# Altium project ControlBoard.PrjPCB (part 1 of 2)
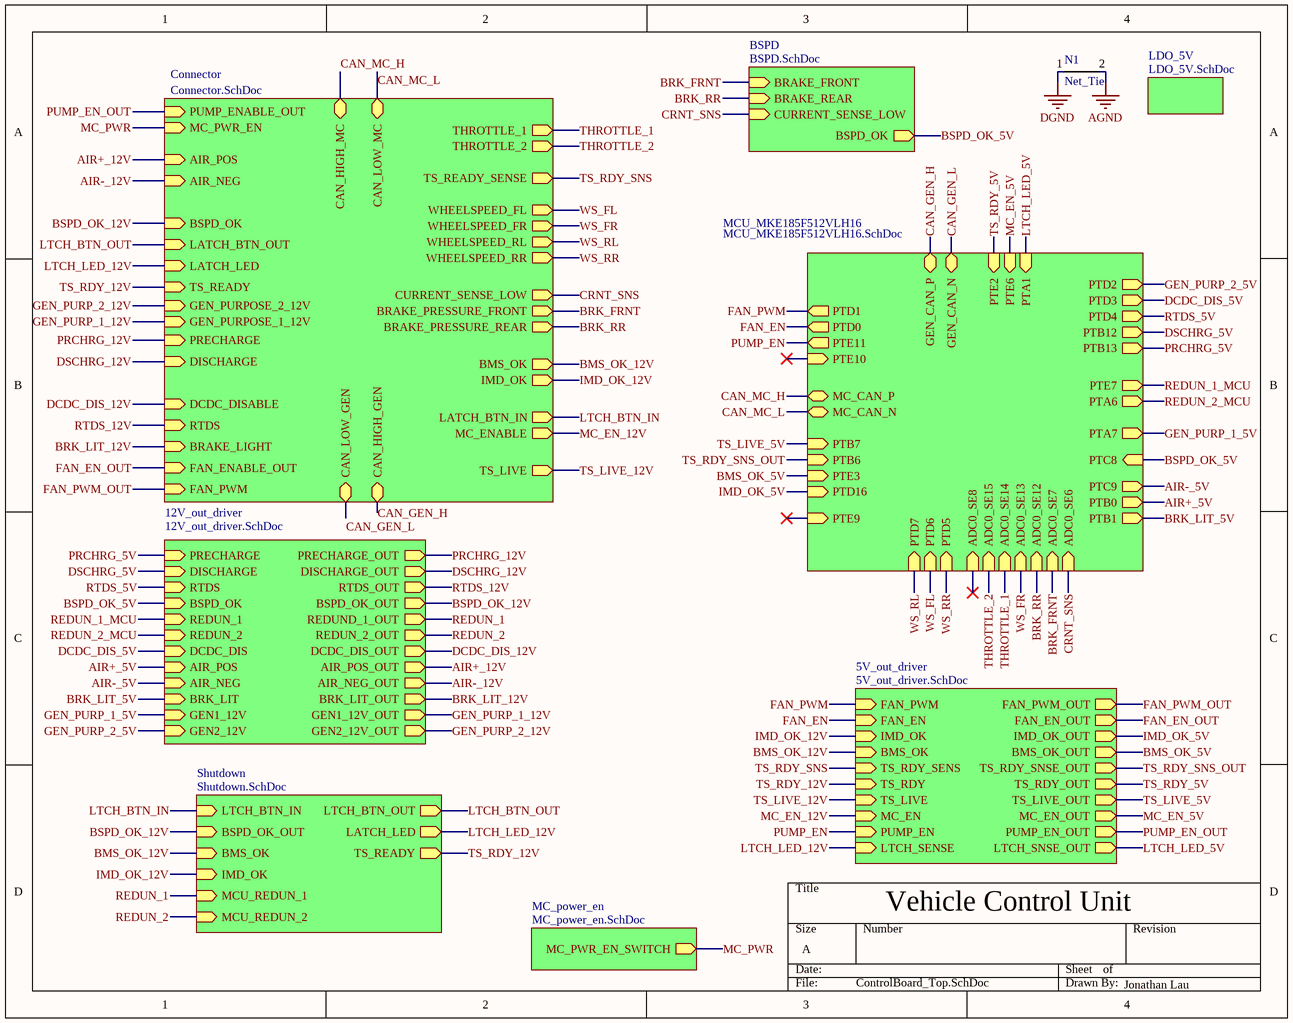
[diagram p0: ControlBoard_Top.SchDoc]
12 sheets, 198 parts. Net scope: hierarchical (ports join the sheet entries above them; power ports are global).
Board files: ControlBoard.PcbDoc, ControlBoard_v2.PcbDoc, ControlBoard_v3.PcbDoc, ControlBoard_v4.PcbDoc
Sheets:
  ControlBoard_Top.SchDoc
    5V_out_driver = 5V_out_driver.SchDoc
    12V_out_driver = 12V_out_driver.SchDoc
    Connector = Connector.SchDoc
      Designator = RVP_OVP_HC.SchDoc
    Shutdown = Shutdown.SchDoc
    BSPD = BSPD.SchDoc
    LDO_5V = LDO_5V.SchDoc
    MC_power_en = MC_power_en.SchDoc
    MCU_MKE185F512VLH16 = MCU_MKE185F512VLH16.SchDoc
      USB = USB.SchDoc
      MC = CAN_Tranceiver.SchDoc
      GEN = CAN_Tranceiver.SchDoc

## Sheet ControlBoard_Top.SchDoc
size A

### Parts
N1  Net_Tie  [Net_Tie]

### Sub-sheets
5V_out_driver = 5V_out_driver.SchDoc: FAN_PWM (in), IMD_OK (in), IMD_OK_OUT (out), MC_EN_OUT (out), TS_LIVE_OUT (out), FAN_PWM_OUT (out), BMS_OK (in), MC_EN (in), TS_LIVE (in), BMS_OK_OUT (out), TS_RDY_OUT (out), FAN_EN_OUT (out), TS_RDY (in), TS_RDY_SENS (in), FAN_EN (in), TS_RDY_SNSE_OUT (out), PUMP_EN_OUT (out), PUMP_EN (in), LTCH_SENSE (in), LTCH_SNSE_OUT (out)
12V_out_driver = 12V_out_driver.SchDoc: PRECHARGE (in), DISCHARGE (in), RTDS (in), BSPD_OK (in), RTDS_OUT (out), PRECHARGE_OUT (out), DISCHARGE_OUT (out), BSPD_OK_OUT (out), REDUN_1 (in), REDUN_2 (in), REDUND_1_OUT (out), REDUN_2_OUT (out), DCDC_DIS_OUT (out), DCDC_DIS (in), BRK_LIT (in), BRK_LIT_OUT (out), GEN2_12V_OUT (out), GEN2_12V (in), GEN1_12V (in), GEN1_12V_OUT (out), AIR_NEG_OUT (out), AIR_POS (in), AIR_NEG (in), AIR_POS_OUT (out)
BSPD = BSPD.SchDoc: BRAKE_FRONT (in), BRAKE_REAR (in), CURRENT_SENSE_LOW (in), BSPD_OK (out)
Connector = Connector.SchDoc: PUMP_ENABLE_OUT (in), MC_PWR_EN (in), THROTTLE_1 (out), WHEELSPEED_RL (out), CURRENT_SENSE_LOW (out), DISCHARGE (in), RTDS (in), WHEELSPEED_FL (out), FAN_ENABLE_OUT (in), MC_ENABLE (out), PRECHARGE (in), CAN_HIGH_GEN (bidir), CAN_LOW_GEN (bidir), BSPD_OK (in), TS_READY_SENSE (out), TS_READY (in), FAN_PWM (in), LATCH_BTN_IN (out), BRAKE_PRESSURE_REAR (out), LATCH_BTN_OUT (in), LATCH_LED (in), WHEELSPEED_FR (out), DCDC_DISABLE (in), BRAKE_LIGHT (in), CAN_LOW_MC (bidir), WHEELSPEED_RR (out), CAN_HIGH_MC (bidir), IMD_OK (out), THROTTLE_2 (out), BRAKE_PRESSURE_FRONT (out), BMS_OK (out), TS_LIVE (out), GEN_PURPOSE_2_12V (in), GEN_PURPOSE_1_12V (in), AIR_NEG (in), AIR_POS (in)
LDO_5V = LDO_5V.SchDoc: no entries
MC_power_en = MC_power_en.SchDoc: MC_PWR_EN_SWITCH (out)
MCU_MKE185F512VLH16 = MCU_MKE185F512VLH16.SchDoc: ADC0_SE6 (in), PTA6 (out), PTD3 (out), PTA1 (in), PTD1 (out), PTB12 (out), PTB13 (out), PTE7 (out), PTB7 (in), PTB6 (in), PTD16 (in), PTE2 (in), PTD4 (out), PTD0 (out), ADC0_SE7 (in), ADC0_SE12 (in), ADC0_SE13 (in), ADC0_SE14 (in), ADC0_SE15 (in), ADC0_SE8 (in), PTE3 (in), PTB0 (out), PTE6 (in), PTD5 (in), PTE9 (in), PTE10 (in), PTE11 (out), PTD6 (in), PTD7 (in), GEN_CAN_P (bidir), MC_CAN_P (bidir), GEN_CAN_N (bidir), MC_CAN_N (bidir), PTC9 (out), PTB1 (out), PTC8 (in), PTA7 (out), PTD2 (out)
Shutdown = Shutdown.SchDoc: BSPD_OK_OUT (in), TS_READY (out), LATCH_LED (out), IMD_OK (in), BMS_OK (in), LTCH_BTN_OUT (out), LTCH_BTN_IN (in), MCU_REDUN_2 (in), MCU_REDUN_1 (in)

### Nets
AGND: N1.2
DGND: N1.1
AIR+_5V: sheet 12V_out_driver/AIR_POS, sheet MCU_MKE185F512VLH16/PTB0
AIR+_12V: sheet 12V_out_driver/AIR_POS_OUT, sheet Connector/AIR_POS
AIR-_5V: sheet 12V_out_driver/AIR_NEG, sheet MCU_MKE185F512VLH16/PTC9
AIR-_12V: sheet 12V_out_driver/AIR_NEG_OUT, sheet Connector/AIR_NEG
BMS_OK_5V: sheet 5V_out_driver/BMS_OK_OUT, sheet MCU_MKE185F512VLH16/PTE3
BMS_OK_12V: sheet 5V_out_driver/BMS_OK, sheet Connector/BMS_OK, sheet Shutdown/BMS_OK  [project net BMS_OK]
BRK_FRNT: sheet Connector/BRAKE_PRESSURE_FRONT, sheet BSPD/BRAKE_FRONT, sheet MCU_MKE185F512VLH16/ADC0_SE7  [project net 5]
BRK_LIT_5V: sheet 12V_out_driver/BRK_LIT, sheet MCU_MKE185F512VLH16/PTB1
BRK_LIT_12V: sheet 12V_out_driver/BRK_LIT_OUT, sheet Connector/BRAKE_LIGHT  [project net BRK_LIGHT_OUT]
BRK_RR: sheet Connector/BRAKE_PRESSURE_REAR, sheet BSPD/BRAKE_REAR, sheet MCU_MKE185F512VLH16/ADC0_SE12  [project net 6]
BSPD_OK_5V: sheet 12V_out_driver/BSPD_OK, sheet BSPD/BSPD_OK, sheet MCU_MKE185F512VLH16/PTC8
BSPD_OK_12V: sheet 12V_out_driver/BSPD_OK_OUT, sheet Connector/BSPD_OK, sheet Shutdown/BSPD_OK_OUT
CAN_GEN_H: sheet Connector/CAN_HIGH_GEN, sheet MCU_MKE185F512VLH16/GEN_CAN_P
CAN_GEN_L: sheet Connector/CAN_LOW_GEN, sheet MCU_MKE185F512VLH16/GEN_CAN_N
CAN_MC_H: sheet Connector/CAN_HIGH_MC, sheet MCU_MKE185F512VLH16/MC_CAN_P
CAN_MC_L: sheet Connector/CAN_LOW_MC, sheet MCU_MKE185F512VLH16/MC_CAN_N
CRNT_SNS: sheet Connector/CURRENT_SENSE_LOW, sheet BSPD/CURRENT_SENSE_LOW, sheet MCU_MKE185F512VLH16/ADC0_SE6  [project net 1]
DCDC_DIS_5V: sheet 12V_out_driver/DCDC_DIS, sheet MCU_MKE185F512VLH16/PTD3
DCDC_DIS_12V: sheet 12V_out_driver/DCDC_DIS_OUT, sheet Connector/DCDC_DISABLE
DSCHRG_5V: sheet 12V_out_driver/DISCHARGE, sheet MCU_MKE185F512VLH16/PTB12
DSCHRG_12V: sheet 12V_out_driver/DISCHARGE_OUT, sheet Connector/DISCHARGE
FAN_EN: sheet 5V_out_driver/FAN_EN, sheet MCU_MKE185F512VLH16/PTD0
FAN_EN_OUT: sheet 5V_out_driver/FAN_EN_OUT, sheet Connector/FAN_ENABLE_OUT
FAN_PWM: sheet 5V_out_driver/FAN_PWM, sheet MCU_MKE185F512VLH16/PTD1
FAN_PWM_OUT: sheet 5V_out_driver/FAN_PWM_OUT, sheet Connector/FAN_PWM
GEN_PURP_1_5V: sheet 12V_out_driver/GEN1_12V, sheet MCU_MKE185F512VLH16/PTA7
GEN_PURP_1_12V: sheet 12V_out_driver/GEN1_12V_OUT, sheet Connector/GEN_PURPOSE_1_12V  [project net GEN1_OUT]
GEN_PURP_2_5V: sheet 12V_out_driver/GEN2_12V, sheet MCU_MKE185F512VLH16/PTD2
GEN_PURP_2_12V: sheet 12V_out_driver/GEN2_12V_OUT, sheet Connector/GEN_PURPOSE_2_12V  [project net GEN2_OUT]
IMD_OK_5V: sheet 5V_out_driver/IMD_OK_OUT, sheet MCU_MKE185F512VLH16/PTD16
IMD_OK_12V: sheet 5V_out_driver/IMD_OK, sheet Connector/IMD_OK, sheet Shutdown/IMD_OK  [project net IMD_OK]
LTCH_BTN_IN: sheet Connector/LATCH_BTN_IN, sheet Shutdown/LTCH_BTN_IN
LTCH_BTN_OUT: sheet Connector/LATCH_BTN_OUT, sheet Shutdown/LTCH_BTN_OUT
LTCH_LED_5V: sheet 5V_out_driver/LTCH_SNSE_OUT, sheet MCU_MKE185F512VLH16/PTA1  [project net LATCH_SENSE_OUT]
LTCH_LED_12V: sheet 5V_out_driver/LTCH_SENSE, sheet Connector/LATCH_LED, sheet Shutdown/LATCH_LED
MC_EN_5V: sheet 5V_out_driver/MC_EN_OUT, sheet MCU_MKE185F512VLH16/PTE6
MC_EN_12V: sheet 5V_out_driver/MC_EN, sheet Connector/MC_ENABLE  [project net MC_EN]
MC_PWR: sheet Connector/MC_PWR_EN, sheet MC_power_en/MC_PWR_EN_SWITCH
PRCHRG_5V: sheet 12V_out_driver/PRECHARGE, sheet MCU_MKE185F512VLH16/PTB13
PRCHRG_12V: sheet 12V_out_driver/PRECHARGE_OUT, sheet Connector/PRECHARGE
PUMP_EN: sheet 5V_out_driver/PUMP_EN, sheet MCU_MKE185F512VLH16/PTE11
PUMP_EN_OUT: sheet 5V_out_driver/PUMP_EN_OUT, sheet Connector/PUMP_ENABLE_OUT
REDUN_1: sheet 12V_out_driver/REDUND_1_OUT, sheet Shutdown/MCU_REDUN_1  [project net MCU_REDUN_1_OUT]
REDUN_1_MCU: sheet 12V_out_driver/REDUN_1, sheet MCU_MKE185F512VLH16/PTE7
REDUN_2: sheet 12V_out_driver/REDUN_2_OUT, sheet Shutdown/MCU_REDUN_2  [project net MCU_REDUN_2_OUT]
REDUN_2_MCU: sheet 12V_out_driver/REDUN_2, sheet MCU_MKE185F512VLH16/PTA6
RTDS_5V: sheet 12V_out_driver/RTDS, sheet MCU_MKE185F512VLH16/PTD4
RTDS_12V: sheet 12V_out_driver/RTDS_OUT, sheet Connector/RTDS
THROTTLE_1: sheet Connector/THROTTLE_1, sheet MCU_MKE185F512VLH16/ADC0_SE14  [project net 3]
THROTTLE_2: sheet Connector/THROTTLE_2, sheet MCU_MKE185F512VLH16/ADC0_SE15  [project net 4]
TS_LIVE_5V: sheet 5V_out_driver/TS_LIVE_OUT, sheet MCU_MKE185F512VLH16/PTB7
TS_LIVE_12V: sheet 5V_out_driver/TS_LIVE, sheet Connector/TS_LIVE
TS_RDY_5V: sheet 5V_out_driver/TS_RDY_OUT, sheet MCU_MKE185F512VLH16/PTE2
TS_RDY_12V: sheet 5V_out_driver/TS_RDY, sheet Connector/TS_READY, sheet Shutdown/TS_READY
TS_RDY_SNS: sheet 5V_out_driver/TS_RDY_SENS, sheet Connector/TS_READY_SENSE
TS_RDY_SNS_OUT: sheet 5V_out_driver/TS_RDY_SNSE_OUT, sheet MCU_MKE185F512VLH16/PTB6
WS_FL: sheet Connector/WHEELSPEED_FL, sheet MCU_MKE185F512VLH16/PTD6  [project net 8]
WS_FR: sheet Connector/WHEELSPEED_FR, sheet MCU_MKE185F512VLH16/ADC0_SE13  [project net 7]
WS_RL: sheet Connector/WHEELSPEED_RL, sheet MCU_MKE185F512VLH16/PTD7  [project net 10]
WS_RR: sheet Connector/WHEELSPEED_RR, sheet MCU_MKE185F512VLH16/PTD5  [project net 9]

### Notes on the sheet
- Vehicle Control Unit
- Jonathan Lau

### Library data of the parts
N1 = 1: Manufacturer_id: 1; idFuse: 3; Name: Net Tie; Drawer_id: 1; idShunt: 1

## Sheet 5V_out_driver.SchDoc
size A
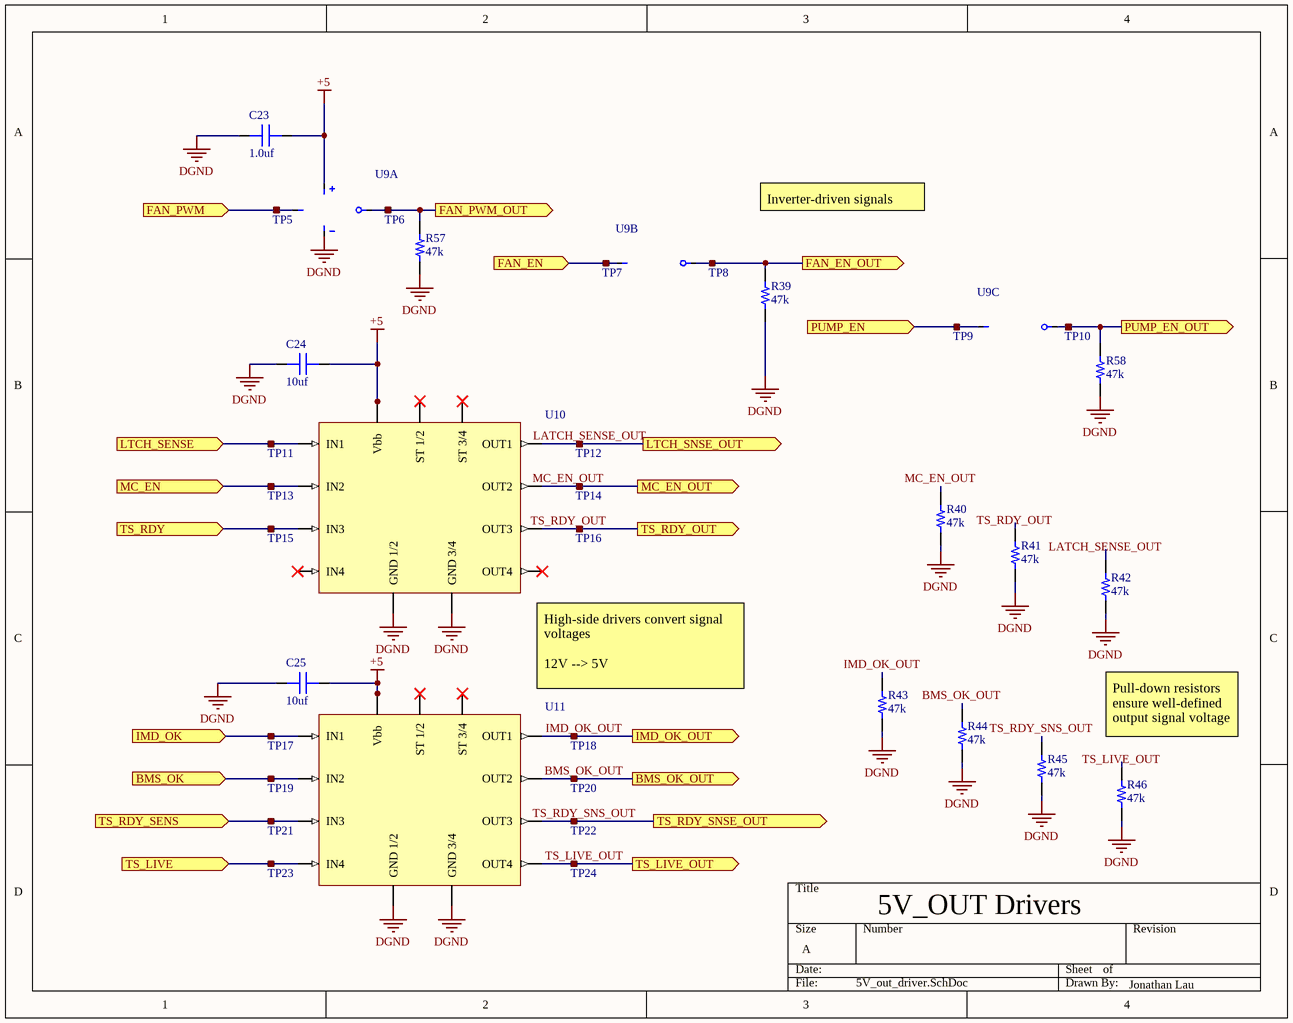
[diagram p1: 5V_out_driver.SchDoc]

### Parts
C23  value 1.0uf  [CAP 0603/1608]  (hidden comment: Capacitor MLCC 1.0uf 16V CAP 0603/1608)
C24  value 10uf  [CAP 0603/1608]  (hidden comment: Capacitor MLCC 10uf 16V CAP 0603/1608)
C25  value 10uf  [CAP 0603/1608]  (hidden comment: Capacitor MLCC 10uf 16V CAP 0603/1608)
R39  value 47k  [RES 0805/2012]  (hidden comment: Resistor 47k 0805 1/4W 5%)
R40  value 47k  [RES 0805/2012]  (hidden comment: Resistor 47k 0805 1/4W 5%)
R41  value 47k  [RES 0805/2012]  (hidden comment: Resistor 47k 0805 1/4W 5%)
R42  value 47k  [RES 0805/2012]  (hidden comment: Resistor 47k 0805 1/4W 5%)
R43  value 47k  [RES 0805/2012]  (hidden comment: Resistor 47k 0805 1/4W 5%)
R44  value 47k  [RES 0805/2012]  (hidden comment: Resistor 47k 0805 1/4W 5%)
R45  value 47k  [RES 0805/2012]  (hidden comment: Resistor 47k 0805 1/4W 5%)
R46  value 47k  [RES 0805/2012]  (hidden comment: Resistor 47k 0805 1/4W 5%)
R57  value 47k  [RES 0805/2012]  (hidden comment: Resistor 47k 0805 1/4W 5%)
R58  value 47k  [RES 0805/2012]  (hidden comment: Resistor 47k 0805 1/4W 5%)
TP5  RCU-0C  [RCU-0C]  (value not drawn)
TP6  RCU-0C  [RCU-0C]  (value not drawn)
TP7  RCU-0C  [RCU-0C]  (value not drawn)
TP8  RCU-0C  [RCU-0C]  (value not drawn)
TP9  RCU-0C  [RCU-0C]  (value not drawn)
TP10  RCU-0C  [RCU-0C]  (value not drawn)
TP11  RCU-0C  [RCU-0C]  (value not drawn)
TP12  RCU-0C  [RCU-0C]  (value not drawn)
TP13  RCU-0C  [RCU-0C]  (value not drawn)
TP14  RCU-0C  [RCU-0C]  (value not drawn)
TP15  RCU-0C  [RCU-0C]  (value not drawn)
TP16  RCU-0C  [RCU-0C]  (value not drawn)
TP17  RCU-0C  [RCU-0C]  (value not drawn)
TP18  RCU-0C  [RCU-0C]  (value not drawn)
TP19  RCU-0C  [RCU-0C]  (value not drawn)
TP20  RCU-0C  [RCU-0C]  (value not drawn)
TP21  RCU-0C  [RCU-0C]  (value not drawn)
TP22  RCU-0C  [RCU-0C]  (value not drawn)
TP23  RCU-0C  [RCU-0C]  (value not drawn)
TP24  RCU-0C  [RCU-0C]  (value not drawn)
U9  SN74LVC3G14DCUR  [R-PDSO-G8]  (value not drawn)  (parts A,B,C of 3)
U10  PG-DSO-20  [PG-DSO-20]  (value not drawn)
U11  PG-DSO-20  [PG-DSO-20]  (value not drawn)

### Ports
BMS_OK (in), BMS_OK_OUT (out), FAN_EN (in), FAN_EN_OUT (out), FAN_PWM (in), FAN_PWM_OUT (out), IMD_OK (in), IMD_OK_OUT (out), LTCH_SENSE (in), LTCH_SNSE_OUT (out), MC_EN (in), MC_EN_OUT (out), PUMP_EN (in), PUMP_EN_OUT (out), TS_LIVE (in), TS_LIVE_OUT (out), TS_RDY (in), TS_RDY_OUT (out), TS_RDY_SENS (in), TS_RDY_SNSE_OUT (out)

### Nets
+5: C23.2 C24.1 C25.1 U9.8(Vcc) U10.1(Vbb) U10.10(Vbb) U10.11(Vbb) U10.12(Vbb) U10.15(Vbb) U10.16(Vbb) U10.19(Vbb) U10.20(Vbb) U11.1(Vbb) U11.10(Vbb) U11.11(Vbb) U11.12(Vbb) U11.15(Vbb) U11.16(Vbb) U11.19(Vbb) U11.20(Vbb)  [project net DVCC]
DGND: C23.1 C24.2 C25.2 R39.1 R40.1 R41.1 R42.1 R43.2 R44.1 R45.1 R46.1 R57.1 R58.1 U9.4(GND) U10.2(GND_1/2) U10.6(GND_3/4) U11.2(GND_1/2) U11.6(GND_3/4)
BMS_OK: TP19.1 U11.5(IN2) ; port BMS_OK
BMS_OK_OUT: R44.2 TP20.1 U11.17(OUT2) ; port BMS_OK_OUT  [project net BMS_OK_5V]
FAN_EN: TP7.1 U9.3(2A) ; port FAN_EN
FAN_EN_OUT: R39.2 TP8.1 U9.5(2Y) ; port FAN_EN_OUT
FAN_PWM: TP5.1 U9.1(1A) ; port FAN_PWM
FAN_PWM_OUT: R57.2 TP6.1 U9.7(1Y) ; port FAN_PWM_OUT
IMD_OK: TP17.1 U11.3(IN1) ; port IMD_OK
IMD_OK_OUT: R43.1 TP18.1 U11.18(OUT1) ; port IMD_OK_OUT  [project net IMD_OK_5V]
LATCH_SENSE_OUT: R42.2 TP12.1 U10.18(OUT1) ; port LTCH_SNSE_OUT
LTCH_LED_12V: TP11.1 U10.3(IN1) ; port LTCH_SENSE
MC_EN: TP13.1 U10.5(IN2) ; port MC_EN
MC_EN_OUT: R40.2 TP14.1 U10.17(OUT2) ; port MC_EN_OUT  [project net MC_EN_5V]
PUMP_EN: TP9.1 U9.6(3A) ; port PUMP_EN
PUMP_EN_OUT: R58.2 TP10.1 U9.2(3Y) ; port PUMP_EN_OUT
TS_LIVE_12V: TP23.1 U11.9(IN4) ; port TS_LIVE
TS_LIVE_OUT: R46.2 TP24.1 U11.13(OUT4) ; port TS_LIVE_OUT  [project net TS_LIVE_5V]
TS_RDY_12V: TP15.1 U10.7(IN3) ; port TS_RDY
TS_RDY_OUT: R41.2 TP16.1 U10.14(OUT3) ; port TS_RDY_OUT  [project net TS_RDY_5V]
TS_RDY_SNS: TP21.1 U11.7(IN3) ; port TS_RDY_SENS
TS_RDY_SNS_OUT: R45.2 TP22.1 U11.14(OUT3) ; port TS_RDY_SNSE_OUT

Not connected (* = marked no-connect by the designer): U10 4(ST_1/2)* 8(ST_3/4)* 9(IN4)* 13(OUT4)*; U11 4(ST_1/2)* 8(ST_3/4)*

### Notes on the sheet
- Inverter-driven signals
- High-side drivers convert signal voltages
  12V --> 5V
- Pull-down resistors ensure well-defined output signal voltage
- 5V_OUT Drivers
- Jonathan Lau

### Library data of the parts
C23 = 229: Manufacturer_id: 1; idCapacitor: 229; Name: Cap_1.0uf_16V_CAP 0603/1608; Dielectric: Ceramic; Created_By: Nick Mah; Drawer_id: 1; Voltage_Rating: 16V; Package: CAP 0603/1608; Created_Date: 10/20/2018
C24 C25 = 235: Manufacturer_id: 1; idCapacitor: 235; Name: Cap_10uf_16V_CAP 0603/1608; Dielectric: Ceramic; Created_By: Nick Mah; Drawer_id: 1; Voltage_Rating: 16V; Package: CAP 0603/1608; Created_Date: 10/20/2018
R39-R46 R57 R58 = 1841: Manufacturer_id: 1; idResistor: 1841; Name: Res_47k_0805_1/4W_5%; Created_By: Nick Mah; Supplier 1: Digi-Key; Drawer_id: 1; Tolerance: 5%; Power: 1/4W; Package: 0805; ComponentLink1Description: Datasheet; Created_Date: 2018-10-20
TP5-TP24 = 5: Manufacturer_id: 1; idTable: 5; Name: RCU-0C_Test_Point; Drawer_id: 1; Package: 0603; MfrPartNo: RCU-0C; Link: https://www.digikey.com/product-detail/en/te-connectivity-amp-connectors/RCU-0C/A106145CT-ND/3477802; ComponentLink1Description: Datasheet; ComponentLink1URL: https://www.te.com/commerce/DocumentDelivery/DDEController?Action=srchrtrv&DocNm=1773266&DocType=DS&DocLang=English
U9 = 30: Manufacturer_id: 1; idIC_Misc: 30; Name: SN74LVC3G14DCUR Inverter; Drawer_id: 1; Link: https://www.digikey.com/product-detail/en/texas-instruments/SN74LVC3G14DCUR/296-13006-1-ND/475831
U10 U11 = 6: High Side Driver; Manufacturer_id: 1; MfrPartNo: BTS716GXUMA1; idIC_Misc: 6; Name: BTS716G High Side Driver; Drawer_id: 1; Link: https://www.digikey.com/product-detail/en/infineon-technologies/BTS716GXUMA1/BTS716GXUMA1CT-ND/520067; ComponentLink1Description: Datasheet; ComponentLink1URL: https://www.infineon.com/dgdl/Infineon-BTS716G-DS-v01_00-EN.pdf?fileId=5546d4625a888733015aa3be86601004

## Sheet 12V_out_driver.SchDoc
size A
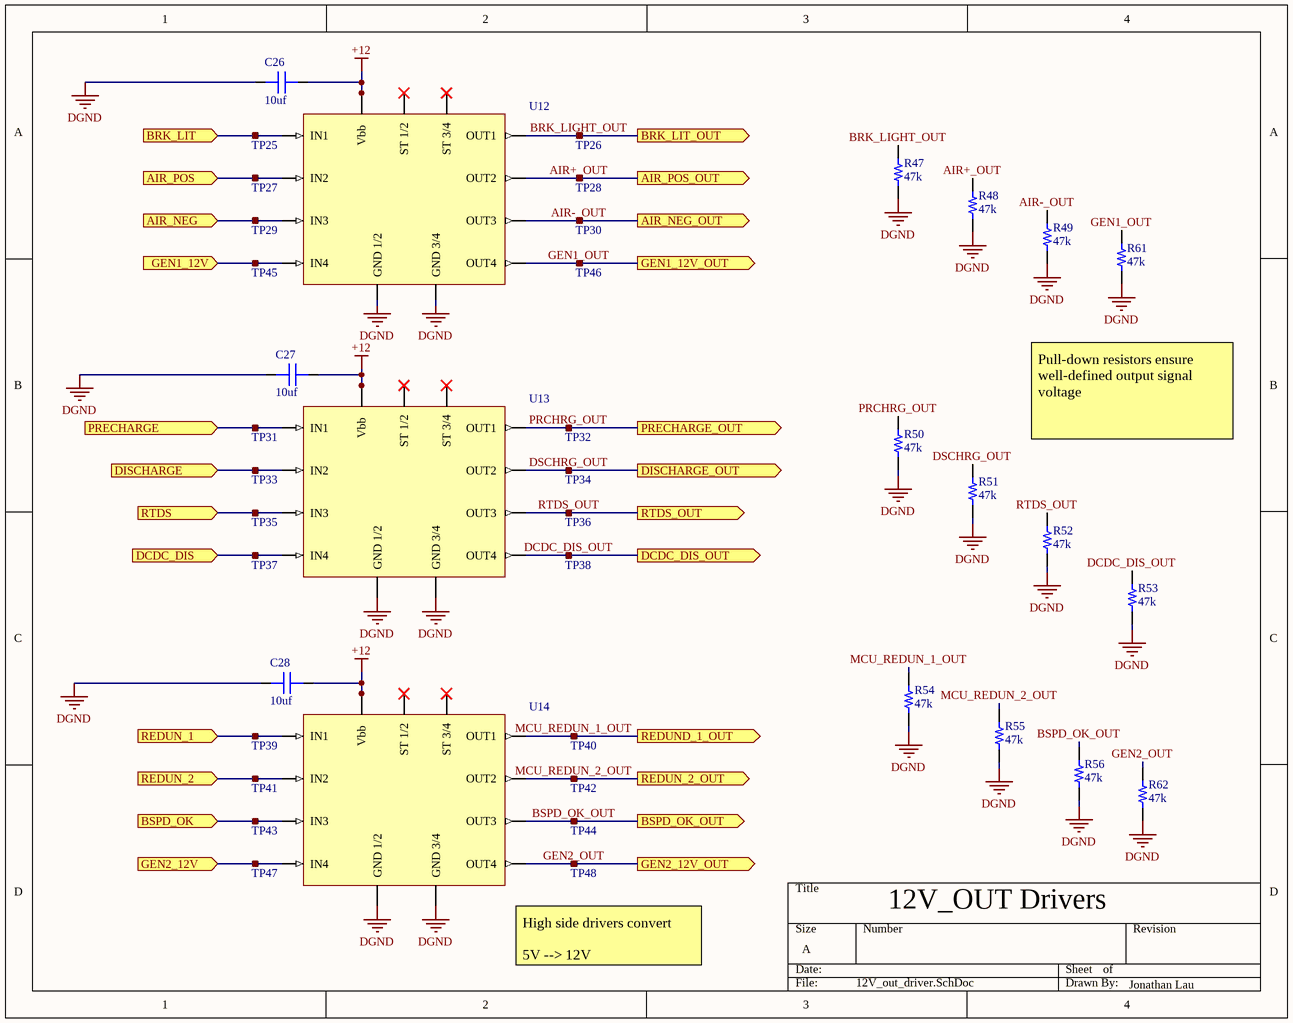
[diagram p2: 12V_out_driver.SchDoc]

### Parts
C26  value 10uf  [CAP 0603/1608]  (hidden comment: Capacitor MLCC 10uf 16V CAP 0603/1608)
C27  value 10uf  [CAP 0603/1608]  (hidden comment: Capacitor MLCC 10uf 16V CAP 0603/1608)
C28  value 10uf  [CAP 0603/1608]  (hidden comment: Capacitor MLCC 10uf 16V CAP 0603/1608)
R47  value 47k  [RES 0805/2012]  (hidden comment: Resistor 47k 0805 1/4W 5%)
R48  value 47k  [RES 0805/2012]  (hidden comment: Resistor 47k 0805 1/4W 5%)
R49  value 47k  [RES 0805/2012]  (hidden comment: Resistor 47k 0805 1/4W 5%)
R50  value 47k  [RES 0805/2012]  (hidden comment: Resistor 47k 0805 1/4W 5%)
R51  value 47k  [RES 0805/2012]  (hidden comment: Resistor 47k 0805 1/4W 5%)
R52  value 47k  [RES 0805/2012]  (hidden comment: Resistor 47k 0805 1/4W 5%)
R53  value 47k  [RES 0805/2012]  (hidden comment: Resistor 47k 0805 1/4W 5%)
R54  value 47k  [RES 0805/2012]  (hidden comment: Resistor 47k 0805 1/4W 5%)
R55  value 47k  [RES 0805/2012]  (hidden comment: Resistor 47k 0805 1/4W 5%)
R56  value 47k  [RES 0805/2012]  (hidden comment: Resistor 47k 0805 1/4W 5%)
R61  value 47k  [RES 0805/2012]  (hidden comment: Resistor 47k 0805 1/4W 5%)
R62  value 47k  [RES 0805/2012]  (hidden comment: Resistor 47k 0805 1/4W 5%)
TP25  RCU-0C  [RCU-0C]  (value not drawn)
TP26  RCU-0C  [RCU-0C]  (value not drawn)
TP27  RCU-0C  [RCU-0C]  (value not drawn)
TP28  RCU-0C  [RCU-0C]  (value not drawn)
TP29  RCU-0C  [RCU-0C]  (value not drawn)
TP30  RCU-0C  [RCU-0C]  (value not drawn)
TP31  RCU-0C  [RCU-0C]  (value not drawn)
TP32  RCU-0C  [RCU-0C]  (value not drawn)
TP33  RCU-0C  [RCU-0C]  (value not drawn)
TP34  RCU-0C  [RCU-0C]  (value not drawn)
TP35  RCU-0C  [RCU-0C]  (value not drawn)
TP36  RCU-0C  [RCU-0C]  (value not drawn)
TP37  RCU-0C  [RCU-0C]  (value not drawn)
TP38  RCU-0C  [RCU-0C]  (value not drawn)
TP39  RCU-0C  [RCU-0C]  (value not drawn)
TP40  RCU-0C  [RCU-0C]  (value not drawn)
TP41  RCU-0C  [RCU-0C]  (value not drawn)
TP42  RCU-0C  [RCU-0C]  (value not drawn)
TP43  RCU-0C  [RCU-0C]  (value not drawn)
TP44  RCU-0C  [RCU-0C]  (value not drawn)
TP45  RCU-0C  [RCU-0C]  (value not drawn)
TP46  RCU-0C  [RCU-0C]  (value not drawn)
TP47  RCU-0C  [RCU-0C]  (value not drawn)
TP48  RCU-0C  [RCU-0C]  (value not drawn)
U12  PG-DSO-20  [PG-DSO-20]  (value not drawn)
U13  PG-DSO-20  [PG-DSO-20]  (value not drawn)
U14  PG-DSO-20  [PG-DSO-20]  (value not drawn)

### Ports
AIR_NEG (in), AIR_NEG_OUT (out), AIR_POS (in), AIR_POS_OUT (out), BRK_LIT (in), BRK_LIT_OUT (out), BSPD_OK (in), BSPD_OK_OUT (out), DCDC_DIS (in), DCDC_DIS_OUT (out), DISCHARGE (in), DISCHARGE_OUT (out), GEN1_12V (in), GEN1_12V_OUT (out), GEN2_12V (in), GEN2_12V_OUT (out), PRECHARGE (in), PRECHARGE_OUT (out), REDUN_1 (in), REDUN_2 (in), REDUN_2_OUT (out), REDUND_1_OUT (out), RTDS (in), RTDS_OUT (out)

### Nets
+12: C26.2 C27.2 C28.2 U12.1(Vbb) U12.10(Vbb) U12.11(Vbb) U12.12(Vbb) U12.15(Vbb) U12.16(Vbb) U12.19(Vbb) U12.20(Vbb) U13.1(Vbb) U13.10(Vbb) U13.11(Vbb) U13.12(Vbb) U13.15(Vbb) U13.16(Vbb) U13.19(Vbb) U13.20(Vbb) U14.1(Vbb) U14.10(Vbb) U14.11(Vbb) U14.12(Vbb) U14.15(Vbb) U14.16(Vbb) U14.19(Vbb) U14.20(Vbb)
DGND: C26.1 C27.1 C28.1 R47.1 R48.1 R49.1 R50.1 R51.1 R52.1 R53.1 R54.1 R55.1 R56.1 R61.1 R62.1 U12.2(GND_1/2) U12.6(GND_3/4) U13.2(GND_1/2) U13.6(GND_3/4) U14.2(GND_1/2) U14.6(GND_3/4)
AIR+_5V: TP27.1 U12.5(IN2) ; port AIR_POS
AIR+_OUT: R48.2 TP28.1 U12.17(OUT2) ; port AIR_POS_OUT  [project net AIR+_12V]
AIR-_5V: TP29.1 U12.7(IN3) ; port AIR_NEG
AIR-_OUT: R49.2 TP30.1 U12.14(OUT3) ; port AIR_NEG_OUT  [project net AIR-_12V]
BRK_LIGHT_OUT: R47.2 TP26.1 U12.18(OUT1) ; port BRK_LIT_OUT
BRK_LIT_5V: TP25.1 U12.3(IN1) ; port BRK_LIT
BSPD_OK_5V: TP43.1 U14.7(IN3) ; port BSPD_OK
BSPD_OK_OUT: R56.2 TP44.1 U14.14(OUT3) ; port BSPD_OK_OUT  [project net BSPD_OK_12V]
DCDC_DIS_5V: TP37.1 U13.9(IN4) ; port DCDC_DIS
DCDC_DIS_OUT: R53.2 TP38.1 U13.13(OUT4) ; port DCDC_DIS_OUT  [project net DCDC_DIS_12V]
DSCHRG_5V: TP33.1 U13.5(IN2) ; port DISCHARGE
DSCHRG_OUT: R51.2 TP34.1 U13.17(OUT2) ; port DISCHARGE_OUT  [project net DSCHRG_12V]
GEN1_OUT: R61.2 TP46.1 U12.13(OUT4) ; port GEN1_12V_OUT
GEN2_OUT: R62.2 TP48.1 U14.13(OUT4) ; port GEN2_12V_OUT
GEN_PURP_1_5V: TP45.1 U12.9(IN4) ; port GEN1_12V
GEN_PURP_2_5V: TP47.1 U14.9(IN4) ; port GEN2_12V
MCU_REDUN_1_OUT: R54.2 TP40.1 U14.18(OUT1) ; port REDUND_1_OUT
MCU_REDUN_2_OUT: R55.2 TP42.1 U14.17(OUT2) ; port REDUN_2_OUT
PRCHRG_5V: TP31.1 U13.3(IN1) ; port PRECHARGE
PRCHRG_OUT: R50.2 TP32.1 U13.18(OUT1) ; port PRECHARGE_OUT  [project net PRCHRG_12V]
REDUN_1_MCU: TP39.1 U14.3(IN1) ; port REDUN_1
REDUN_2_MCU: TP41.1 U14.5(IN2) ; port REDUN_2
RTDS_5V: TP35.1 U13.7(IN3) ; port RTDS
RTDS_OUT: R52.2 TP36.1 U13.14(OUT3) ; port RTDS_OUT  [project net RTDS_12V]

Not connected (* = marked no-connect by the designer): U12 4(ST_1/2)* 8(ST_3/4)*; U13 4(ST_1/2)* 8(ST_3/4)*; U14 4(ST_1/2)* 8(ST_3/4)*

### Notes on the sheet
- Pull-down resistors ensure well-defined output signal voltage
- (near U14) High side drivers convert
  5V --> 12V
- 12V_OUT Drivers
- Jonathan Lau

### Library data of the parts
C26-C28 = 235: as C24 on sheet 5V_out_driver; Drawer_id: 1; Voltage_Rating: 16V; Package: CAP 0603/1608; Created_Date: 10/20/2018
R47-R56 R61 R62 = 1841: as R39 on sheet 5V_out_driver; Supplier 1: Digi-Key; Drawer_id: 1; Tolerance: 5%; Power: 1/4W; Package: 0805; ComponentLink1Description: Datasheet; Created_Date: 2018-10-20
TP25-TP48 = 5: as TP5 on sheet 5V_out_driver; Drawer_id: 1; Package: 0603; MfrPartNo: RCU-0C; Link: https://www.digikey.com/product-detail/en/te-connectivity-amp-connectors/RCU-0C/A106145CT-ND/3477802; ComponentLink1Description: Datasheet; ComponentLink1URL: https://www.te.com/commerce/DocumentDelivery/DDEController?Action=srchrtrv&DocNm=1773266&DocType=DS&DocLang=English
U12-U14 = 6: as U10 on sheet 5V_out_driver; Drawer_id: 1; Link: https://www.digikey.com/product-detail/en/infineon-technologies/BTS716GXUMA1/BTS716GXUMA1CT-ND/520067; ComponentLink1Description: Datasheet; ComponentLink1URL: https://www.infineon.com/dgdl/Infineon-BTS716G-DS-v01_00-EN.pdf?fileId=5546d4625a888733015aa3be86601004

## Sheet Connector.SchDoc
size A
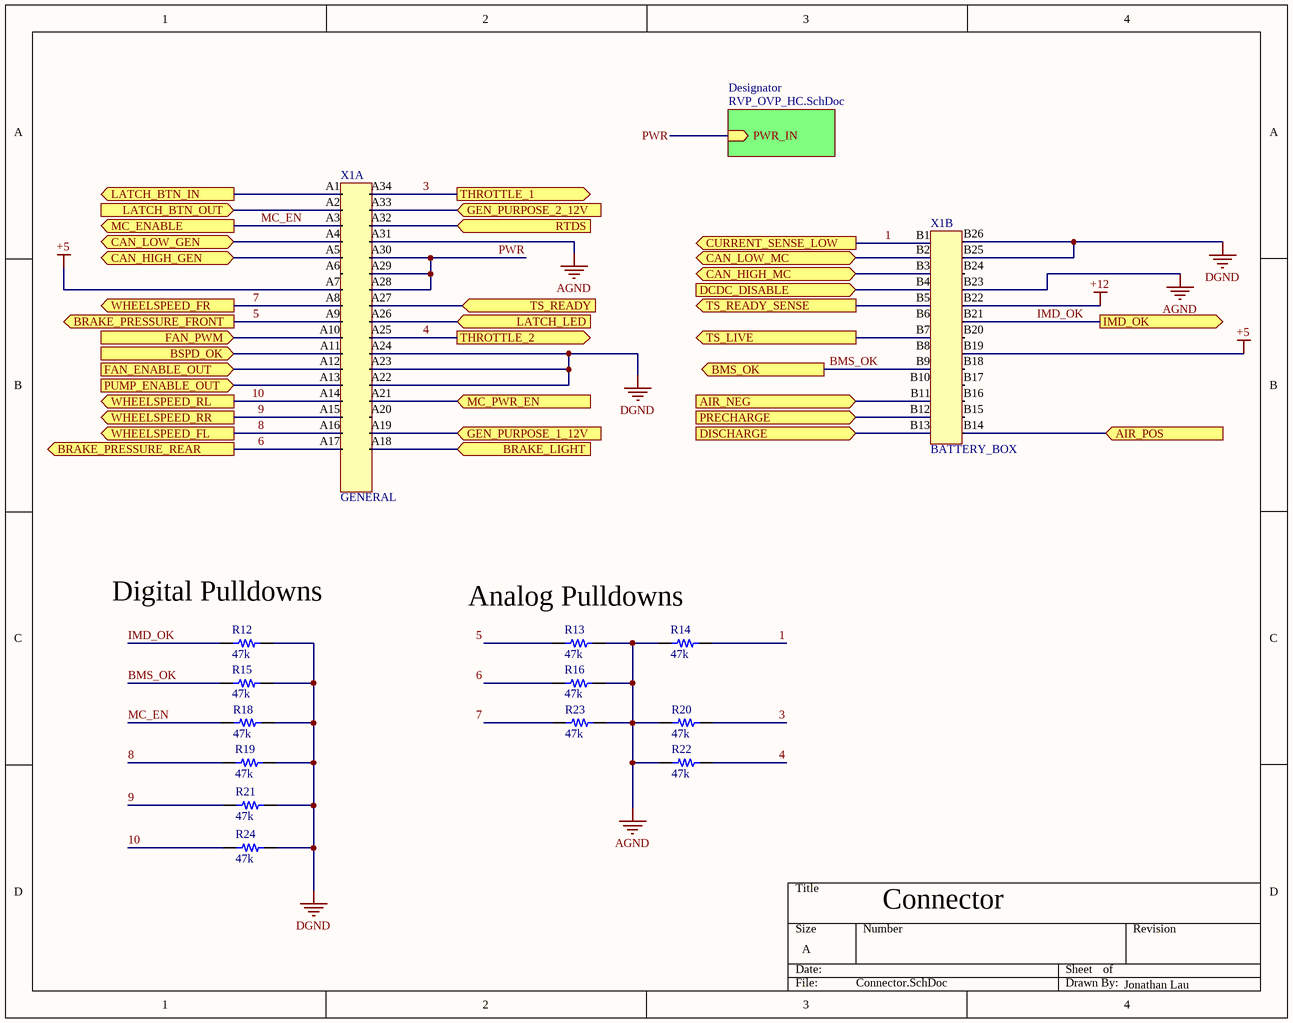
[diagram p3: Connector.SchDoc]

### Parts
R12  value 47k  [RES 0805/2012]  (hidden comment: Resistor 47k 0805 1/10W 1%)
R13  value 47k  [RES 0805/2012]  (hidden comment: Resistor 47k 0805 1/10W 5%)
R14  value 47k  [RES 0805/2012]  (hidden comment: Resistor 47k 0805 1/10W 5%)
R15  value 47k  [RES 0805/2012]  (hidden comment: Resistor 47k 0805 1/10W 1%)
R16  value 47k  [RES 0805/2012]  (hidden comment: Resistor 47k 0805 1/10W 5%)
R18  value 47k  [RES 0805/2012]  (hidden comment: Resistor 47k 0805 1/10W 1%)
R19  value 47k  [RES 0805/2012]  (hidden comment: Resistor 47k 0805 1/10W 5%)
R20  value 47k  [RES 0805/2012]  (hidden comment: Resistor 47k 0805 1/10W 5%)
R21  value 47k  [RES 0805/2012]  (hidden comment: Resistor 47k 0805 1/10W 5%)
R22  value 47k  [RES 0805/2012]  (hidden comment: Resistor 47k 0805 1/10W 5%)
R23  value 47k  [RES 0805/2012]  (hidden comment: Resistor 47k 0805 1/10W 5%)
R24  value 47k  [RES 0805/2012]  (hidden comment: Resistor 47k 0805 1/10W 5%)
X1  GENERAL  [SUPERSEAL 60POS 90Deg]  (parts A,B of 2)

### Sub-sheets
Designator = RVP_OVP_HC.SchDoc: PWR_IN (in)

### Ports
AIR_NEG (in), AIR_POS (in), BMS_OK (out), BRAKE_LIGHT (in), BRAKE_PRESSURE_FRONT (out), BRAKE_PRESSURE_REAR (out), BSPD_OK (in), CAN_HIGH_GEN (bidir), CAN_HIGH_MC (bidir), CAN_LOW_GEN (bidir), CAN_LOW_MC (bidir), CURRENT_SENSE_LOW (out), DCDC_DISABLE (in), DISCHARGE (in), FAN_ENABLE_OUT (in), FAN_PWM (in), GEN_PURPOSE_1_12V (in), GEN_PURPOSE_2_12V (in), IMD_OK (out), LATCH_BTN_IN (out), LATCH_BTN_OUT (in), LATCH_LED (in), MC_ENABLE (out), MC_PWR_EN (in), PRECHARGE (in), PUMP_ENABLE_OUT (in), RTDS (in), THROTTLE_1 (out), THROTTLE_2 (out), TS_LIVE (out), TS_READY (in), TS_READY_SENSE (out), WHEELSPEED_FL (out), WHEELSPEED_FR (out), WHEELSPEED_RL (out), WHEELSPEED_RR (out)

### Nets
+5: X1.A7 X1.B19  [project net DVCC]
+12: X1.B22
AGND: R13.2 R14.1 R16.2 R20.1 R22.1 R23.2 X1.A31 X1.B23
DGND: R12.2 R15.2 R18.2 R19.2 R21.2 R24.2 X1.A22 X1.A23 X1.A24 X1.B25 X1.B26
1: R14.2 X1.B1 ; port CURRENT_SENSE_LOW
3: R20.2 X1.A34 ; port THROTTLE_1
4: R22.2 X1.A25 ; port THROTTLE_2
5: R13.1 X1.A9 ; port BRAKE_PRESSURE_FRONT
6: R16.1 X1.A17 ; port BRAKE_PRESSURE_REAR
7: R23.1 X1.A8 ; port WHEELSPEED_FR
8: R19.1 X1.A16 ; port WHEELSPEED_FL
9: R21.1 X1.A15 ; port WHEELSPEED_RR
10: R24.1 X1.A14 ; port WHEELSPEED_RL
AIR+_12V: X1.B14 ; port AIR_POS
AIR-_12V: X1.B11 ; port AIR_NEG
BMS_OK: R15.1 X1.B9 ; port BMS_OK
BRK_LIGHT_OUT: X1.A18 ; port BRAKE_LIGHT
BSPD_OK_12V: X1.A11 ; port BSPD_OK
CAN_GEN_H: X1.A5 ; port CAN_HIGH_GEN
CAN_GEN_L: X1.A4 ; port CAN_LOW_GEN
CAN_MC_H: X1.B3 ; port CAN_HIGH_MC
CAN_MC_L: X1.B2 ; port CAN_LOW_MC
DCDC_DIS_12V: X1.B4 ; port DCDC_DISABLE
DSCHRG_12V: X1.B13 ; port DISCHARGE
FAN_EN_OUT: X1.A12 ; port FAN_ENABLE_OUT
FAN_PWM_OUT: X1.A10 ; port FAN_PWM
GEN1_OUT: X1.A19 ; port GEN_PURPOSE_1_12V
GEN2_OUT: X1.A33 ; port GEN_PURPOSE_2_12V
IMD_OK: R12.1 X1.B21 ; port IMD_OK
LTCH_BTN_IN: X1.A1 ; port LATCH_BTN_IN
LTCH_BTN_OUT: X1.A2 ; port LATCH_BTN_OUT
LTCH_LED_12V: X1.A26 ; port LATCH_LED
MC_EN: R18.1 X1.A3 ; port MC_ENABLE
MC_PWR: X1.A21 ; port MC_PWR_EN
PRCHRG_12V: X1.B12 ; port PRECHARGE
PUMP_EN_OUT: X1.A13 ; port PUMP_ENABLE_OUT
PWR: X1.A28 X1.A29 X1.A30 ; sheet Designator/PWR_IN
RTDS_12V: X1.A32 ; port RTDS
TS_LIVE_12V: X1.B7 ; port TS_LIVE
TS_RDY_12V: X1.A27 ; port TS_READY
TS_RDY_SNS: X1.B5 ; port TS_READY_SENSE

Not connected (* = marked no-connect by the designer): X1 A6 A20 B6 B8 B10 B15 B16 B17 B18 B20 B24

### Notes on the sheet
- (near R12) Digital Pulldowns
- Analog Pulldowns
- Connector
- Jonathan Lau

### Library data of the parts
R12 R15 R18 = 545: Manufacturer_id: 1; idResistor: 545; Name: Res_47k_0805_1/10W_1%; Created_By: Nick Mah; Supplier 1: Digi-Key; Drawer_id: 1; Tolerance: 1%; Power: 1/10W; Package: 0805; ComponentLink1Description: Datasheet; Created_Date: 2018-10-20
R13 R14 R16 R19-R24 = 1625: Manufacturer_id: 1; idResistor: 1625; Name: Res_47k_0805_1/10W_5%; Created_By: Nick Mah; Supplier 1: Digi-Key; Drawer_id: 1; Tolerance: 5%; Power: 1/10W; Package: 0805; ComponentLink1Description: Datasheet; Created_Date: 2018-10-20
X1 = 3: 90 Degree; MfrPartNo: 3-6437285-2; Manufacturer_id: 1; idConn: 3; Name: AMP Superseal 60POS 90Deg; Value: CONN; Num_Contacts: 60; Num_Rows: 4; Pitch: 3 mm; Drawer_id: 1; Link: https://www.te.com/usa-en/product-3-6437285-2.html; ComponentLink1Description: Datasheet

## Sheet RVP_OVP_HC.SchDoc
size A
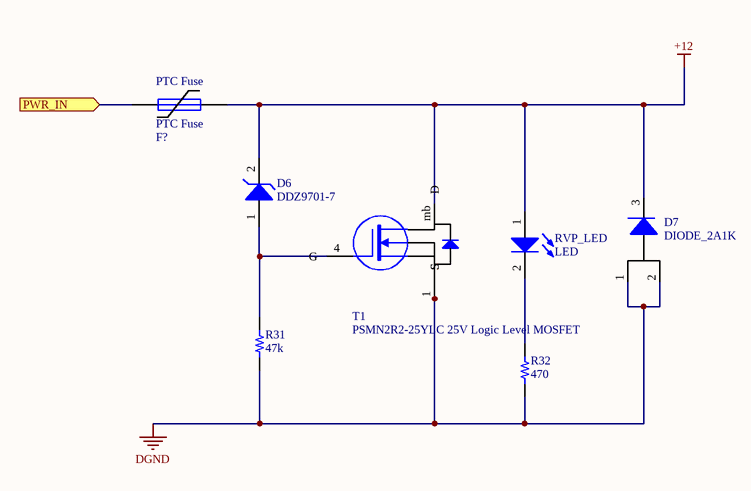
[diagram p4: RVP_OVP_HC.SchDoc]

### Parts
D6  DDZ9701-7  [SOD123F]
D7  DIODE_2A1K  [TO-277]
PTC_Fuse  PTC Fuse  I-hold: F?  [PTC Fuse 2920/07351]
R31  value 47k  [RES 0805/2012]  (hidden comment: Resistor 47k 0805 1/10W 1%)
R32  value 470  [RES 0805/2012]  (hidden comment: Resistor 470 0805 1/10W 1%)
RVP_LED  LED  [0805_LED]
T1  PSMN2R2-25YLC 25V Logic Level MOSFET  [LFPAK-SO8]

### Ports
PWR_IN (in)

### Nets
+12: D6.2(K) D7.3(K) PTC_Fuse.2 RVP_LED.1(A) T1.mb(D)
DGND: D7.1(A1) D7.2(A2) R31.1 R32.1 T1.1(S) T1.2(S) T1.3(S)
PWR: PTC_Fuse.1 ; port PWR_IN
NetD6_1: D6.1(A) R31.2 T1.4(G)
NetR32_2: R32.2 RVP_LED.2(K)

### Library data of the parts
D6 = 10: Zener Diode 14V 500mW ±5% Surface Mount SOD-123; Manufacturer_id: 8; idDiode: 10; Drawer_id: 1; Value: 14Vz; MfrPartNo: DDZ9701-7; Name: DDZ9701; Type: Zener; Num_Circuits: 1; Power: 500mW; Package: SOD-123; Link: https://www.digikey.com/product-detail/en/diodes-incorporated/DDZ9701-7/DDZ9701-7DICT-ND/3877402; ComponentLink1Description: Datasheet; ComponentLink1URL: https://www.diodes.com/assets/Datasheets/ds30410.pdf; Supplier1: Digi-Key; Supplier1PartNo: DDZ9701-7DICT-ND
D7 = 11: Manufacturer_id: 1; idDiode: 11; Name: FSV20100V; Value: 20 A; Type: Schottky; Drawer_id: 1; Package: TO-277; MfrPartNo: FSV20100V; Link: https://www.digikey.com/product-detail/en/on-semiconductor/FSV20100V/FSV20100VCT-ND/5306682; ComponentLink1Description: Datasheet; ComponentLink1URL: https://www.fairchildsemi.com/datasheets/FS/FSV20100V.pdf; Supplier1PartNo: FSV20100VCT-ND
PTC_Fuse = 4: Fuse; Manufacturer_id: 1; MfrPartNo: 2920L200; idFuse: 4; Name: PTC Poly Fuse Resettable; Value: 2A hold, 4A trip, 40A max; I_hold: 2A; I_trip: 4A; I_max: 40A; Created_By: Eunice Bernardo; Published: 8-Jun-2000; LatestRevisionDate: 17-Jul-2002; LatestRevisionNote: Re-released for DXP Platform.; PackageReference: PIN-W2/E2.8; Publisher: Altium Limited; PackageDescription: Thru-Hole; 2 Leads; Drawer_id: 1; Link: https://www.digikey.com/product-detail/en/littelfuse-inc/2920L200-24DR/F2872TR-ND/1211346; Created_Date: 10/27/2018
R31 = 545: as R12 on sheet Connector; Supplier 1: Digi-Key; Drawer_id: 1; Tolerance: 1%; Power: 1/10W; Package: 0805; ComponentLink1Description: Datasheet; Created_Date: 2018-10-20
R32 = 497: Manufacturer_id: 1; idResistor: 497; Name: Res_470_0805_1/10W_1%; Created_By: Nick Mah; Supplier 1: Digi-Key; Drawer_id: 1; Tolerance: 1%; Power: 1/10W; Package: 0805; ComponentLink1Description: Datasheet; Created_Date: 2018-10-20
RVP_LED = 2: Manufacturer_id: 1; idLED: 2; Name: CMD17_0805_GREEN; Value: Green; Brightness: 7mcd; Id: 20mA; Vf: 2.1V; Drawer_id: 1; Package: 0805; Link: https://www.digikey.com/product-detail/en/visual-communications-company-vcc/CMD17-21VGD-TR8/L62505CT-ND/254936
T1 = 3: N-Channel 25V 100A (Tc) 106W (Tc) Surface Mount LFPAK56, Power-SO8; Manufacturer_id: 6; MfrPartNo: PSMN2R2-25YLC,115; idFETs: 3; Drawer_id: 1; Value: N_Channel; Rds_On: 2.5mOhm; Vgs(typ): 10V; Vgs(Max): 20V; Created_By: Nick; Name: PSMN2R2; Vdss: 25V; Num_Circuits: 1; Id: 100A; Package: LFPAK-SO8; Link: https://www.digikey.com/product-detail/en/nexperia-usa-inc/PSMN2R2-25YLC115/1727-5299-1-ND/2674299; ComponentLink1Description: Datasheet; ComponentLink1URL: https://assets.nexperia.com/documents/data-sheet/PSMN2R2-25YLC.pdf; Supplier1: Digi-Key; Supplier1PartNo: 1727-5299-1-ND

## Sheet Shutdown.SchDoc
size A
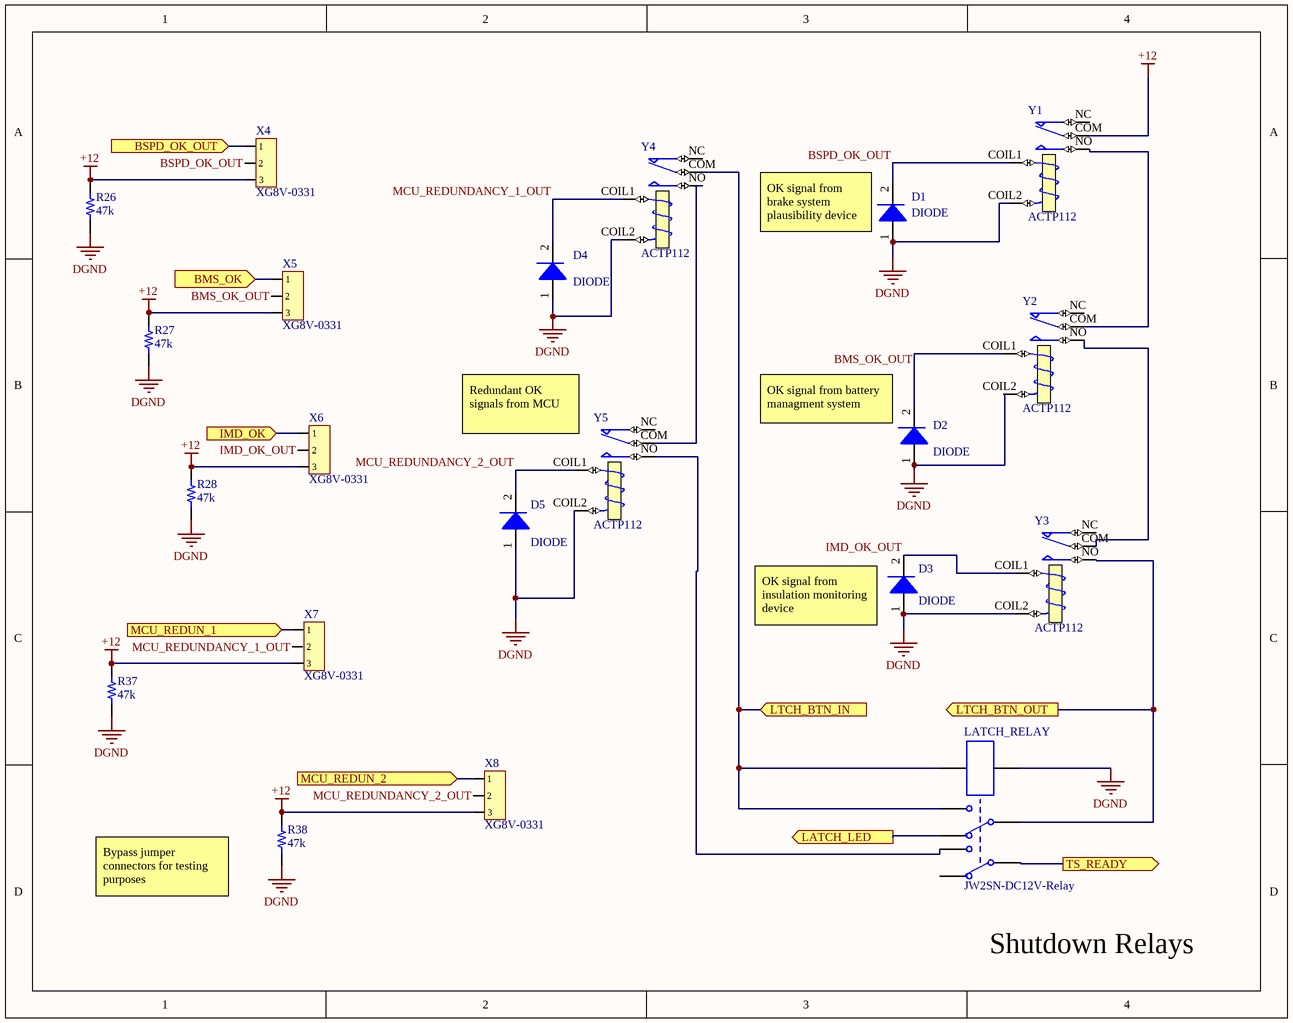
[diagram p5: Shutdown.SchDoc]

### Parts
D1  DIODE  [SOD123F]
D2  DIODE  [SOD123F]
D3  DIODE  [SOD123F]
D4  DIODE  [SOD123F]
D5  DIODE  [SOD123F]
LATCH_RELAY  JW2SN-DC12V-Relay  [JW2SN-DC12V-Relay]
R26  value 47k  [RES 0805/2012]  (hidden comment: Resistor 47k 0805 1/4W 5%)
R27  value 47k  [RES 0805/2012]  (hidden comment: Resistor 47k 0805 1/4W 5%)
R28  value 47k  [RES 0805/2012]  (hidden comment: Resistor 47k 0805 1/4W 5%)
R37  value 47k  [RES 0805/2012]  (hidden comment: Resistor 47k 0805 1/4W 5%)
R38  value 47k  [RES 0805/2012]  (hidden comment: Resistor 47k 0805 1/4W 5%)
X4  XG8V-0331  [XG8V-0331]
X5  XG8V-0331  [XG8V-0331]
X6  XG8V-0331  [XG8V-0331]
X7  XG8V-0331  [XG8V-0331]
X8  XG8V-0331  [XG8V-0331]
Y1  ACTP112  [ACTP112]
Y2  ACTP112  [ACTP112]
Y3  ACTP112  [ACTP112]
Y4  ACTP112  [ACTP112]
Y5  ACTP112  [ACTP112]

### Ports
BMS_OK (in), BSPD_OK_OUT (in), IMD_OK (in), LATCH_LED (out), LTCH_BTN_IN (in), LTCH_BTN_OUT (out), MCU_REDUN_1 (in), MCU_REDUN_2 (in), TS_READY (out)

### Nets
+12: R26.2 R27.2 R28.2 R37.2 R38.2 X4.3 X5.3 X6.3 X7.3 X8.3 Y1.COM
DGND: D1.1(A) D2.1(A) D3.1(A) D4.1(A) D5.1(A) LATCH_RELAY.1(COIL1) R26.1 R27.1 R28.1 R37.1 R38.1 Y1.COIL2(T2) Y2.COIL2(T2) Y3.COIL2(T2) Y4.COIL2(T2) Y5.COIL2(T2)
BMS_OK: X5.1 ; port BMS_OK
BMS_OK_OUT: D2.2(K) X5.2 Y2.COIL1(T1)
BSPD_OK_12V: X4.1 ; port BSPD_OK_OUT
BSPD_OK_OUT: X4.2
IMD_OK: X6.1 ; port IMD_OK
IMD_OK_OUT: D3.2(K) X6.2 Y3.COIL1(T1)
LTCH_BTN_IN: LATCH_RELAY.4(N.O1) LATCH_RELAY.8(COIL2) Y4.COM ; port LTCH_BTN_IN
LTCH_BTN_OUT: LATCH_RELAY.3(COM1) Y3.NO ; port LTCH_BTN_OUT
LTCH_LED_12V: LATCH_RELAY.2(N.C1) ; port LATCH_LED
MCU_REDUN_1_OUT: X7.1 ; port MCU_REDUN_1
MCU_REDUN_2_OUT: X8.1 ; port MCU_REDUN_2
MCU_REDUNDANCY_1_OUT: D4.2(K) X7.2 Y4.COIL1(T1)
MCU_REDUNDANCY_2_OUT: D5.2(K) X8.2 Y5.COIL1(T1)
TS_RDY_12V: LATCH_RELAY.6(COM2) ; port TS_READY
NetD1_2: D1.2(K) Y1.COIL1(T1)
NetLATCH_RELAY_5: LATCH_RELAY.5(N.O2) Y5.NO
NetY1_NO: Y1.NO Y2.COM
NetY2_NO: Y2.NO Y3.COM
NetY4_NO: Y4.NO Y5.COM

Not connected (* = marked no-connect by the designer): LATCH_RELAY 7(N.C2); Y1 NC; Y2 NC; Y3 NC; Y4 NC; Y5 NC

### Notes on the sheet
- (near D1) OK signal from brake system plausibility device
- (near Y5) Redundant OK signals from MCU
- (near D2) OK signal from battery managment system
- (near D3) OK signal from insulation monitoring device
- (near R38) Bypass jumper connectors for testing purposes
- (near LATCH_RELAY) Shutdown Relays
- Labels drawn without touching a wire or pin: BSPD_OK_OUT

### Library data of the parts
D1-D5 = 9: idDiode: 9
LATCH_RELAY = 2: Manufacturer_id: 1; idRelay: 2; Name: Relay JW2SN-DC12; Drawer_id: 1
R26-R28 R37 R38 = 1841: as R39 on sheet 5V_out_driver; Supplier 1: Digi-Key; Drawer_id: 1; Tolerance: 5%; Power: 1/4W; Package: 0805; ComponentLink1Description: Datasheet; Created_Date: 2018-10-20
X4-X8 = 8: 3 pin header; Manufacturer_id: 1; idConn: 8; Name: XG8V-0331_3pin_header; Num_Contacts: 3; Pitch: 2.54 mm; Drawer_id: 1; Link: https://www.digikey.com/products/en/connectors-interconnects/rectangular-connectors-headers-male-pins/314?k=jumper&k=&pkeyword=jumper&pv88=5&sf=0&FV=ffe0013a&quantity=&ColumnSort=0&page=1&pageSize=25; ComponentLink1Description: Datasheet
Y1-Y5 = 3: Manufacturer_id: 1; idRelay: 3; Coil_Voltage: 12V; Published: 8-Jun-2000; LatestRevisionDate: 17-Jul-2002; LatestRevisionNote: Re-released for DXP Platform.; PackageReference: MODULE5B; Publisher: Altium Limited; Drawer_id: 1; Name: ACTP112

## Sheet BSPD.SchDoc
size A
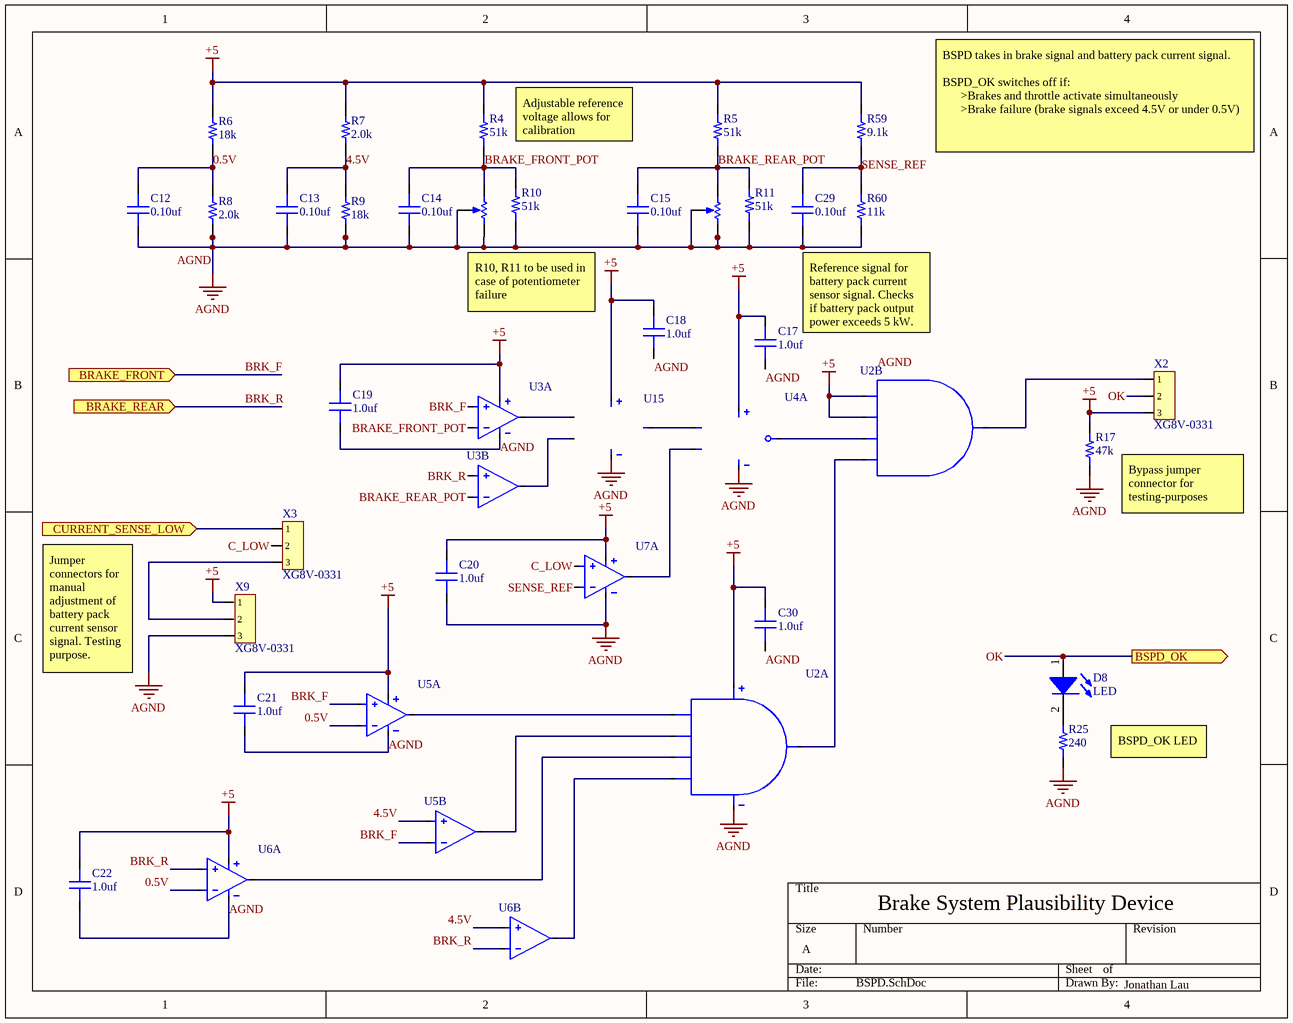
[diagram p6: BSPD.SchDoc]

### Parts
BRAKE_FRONT_POT  RV6LAYSA502A  [RV6LAYSA502A]  (value not drawn)
BRAKE_REAR_POT  RV6LAYSA502A  [RV6LAYSA502A]  (value not drawn)
C12  value 0.10uf  [CAP 0805/2012]  (hidden comment: Capacitor MLCC 0.10uf 16V CAP 0805/2012)
C13  value 0.10uf  [CAP 0805/2012]  (hidden comment: Capacitor MLCC 0.10uf 16V CAP 0805/2012)
C14  value 0.10uf  [CAP 0805/2012]  (hidden comment: Capacitor MLCC 0.10uf 16V CAP 0805/2012)
C15  value 0.10uf  [CAP 0805/2012]  (hidden comment: Capacitor MLCC 0.10uf 16V CAP 0805/2012)
C17  value 1.0uf  [CAP 0603/1608]  (hidden comment: Capacitor MLCC 1.0uf 16V CAP 0603/1608)
C18  value 1.0uf  [CAP 0603/1608]  (hidden comment: Capacitor MLCC 1.0uf 16V CAP 0603/1608)
C19  value 1.0uf  [CAP 0603/1608]  (hidden comment: Capacitor MLCC 1.0uf 16V CAP 0603/1608)
C20  value 1.0uf  [CAP 0603/1608]  (hidden comment: Capacitor MLCC 1.0uf 16V CAP 0603/1608)
C21  value 1.0uf  [CAP 0603/1608]  (hidden comment: Capacitor MLCC 1.0uf 16V CAP 0603/1608)
C22  value 1.0uf  [CAP 0603/1608]  (hidden comment: Capacitor MLCC 1.0uf 16V CAP 0603/1608)
C29  value 0.10uf  [CAP 0805/2012]  (hidden comment: Capacitor MLCC 0.10uf 16V CAP 0805/2012)
C30  value 1.0uf  [CAP 0603/1608]  (hidden comment: Capacitor MLCC 1.0uf 16V CAP 0603/1608)
D8  LED  [0805_LED]
R4  value 51k  [RES 0805/2012]  (hidden comment: Resistor 51k 0805 1/4W 5%)
R5  value 51k  [RES 0805/2012]  (hidden comment: Resistor 51k 0805 1/4W 5%)
R6  value 18k  [RES 0805/2012]  (hidden comment: Resistor 18k 0805 1/4W 5%)
R7  value 2.0k  [RES 0805/2012]  (hidden comment: Resistor 2.0k 0805 1/4W 5%)
R8  value 2.0k  [RES 0805/2012]  (hidden comment: Resistor 2.0k 0805 1/4W 5%)
R9  value 18k  [RES 0805/2012]  (hidden comment: Resistor 18k 0805 1/4W 5%)
R10  value 51k  [RES 0805/2012]  (hidden comment: Resistor 51k 0805 1/4W 5%)
R11  value 51k  [RES 0805/2012]  (hidden comment: Resistor 51k 0805 1/4W 5%)
R17  value 47k  [RES 0805/2012]  (hidden comment: Resistor 47k 0805 1/4W 5%)
R25  value 240  [RES 0805/2012]  (hidden comment: Resistor 240 0805 1/4W 1%)
R59  value 9.1k  [RES 0805/2012]  (hidden comment: Resistor 9.1k 0805 1/4W 1%)
R60  value 11k  [RES 0805/2012]  (hidden comment: Resistor 11k 0805 1/4W 1%)
U2  74HC21D AND Gate  [SOT108-1]  (value not drawn)  (parts A,B of 2)
U3  LT1018 Dual Comparator  [SOIC-8]  (value not drawn)  (parts A,B of 2)
U4  SN74LVC2G132DCUR  [R-PDSO-G8]  (value not drawn)  (part A of 2)
U5  LT1018 Dual Comparator  [SOIC-8]  (value not drawn)  (parts A,B of 2)
U6  LT1018 Dual Comparator  [SOIC-8]  (value not drawn)  (parts A,B of 2)
U7  LT1018 Dual Comparator  [SOIC-8]  (value not drawn)  (part A of 2)
U15  SN74LVC1G32 OR Gate  [SOT23-5]  (value not drawn)
X2  XG8V-0331  [XG8V-0331]
X3  XG8V-0331  [XG8V-0331]
X9  XG8V-0331  [XG8V-0331]

### Ports
BRAKE_FRONT (in), BRAKE_REAR (in), BSPD_OK (out), CURRENT_SENSE_LOW (in)

### Nets
+5: C17.2 C18.2 C19.2 C20.2 C21.2 C22.2 C30.2 R4.2 R5.2 R6.2 R7.2 R17.2 R59.2 U2.9(2A) U2.10(2B) U2.14(Vcc) U3.6(V+) U4.8(Vcc) U5.6(V+) U6.6(V+) U7.6(V+) U15.5(Vcc) X2.3 X9.1  [project net DVCC]
AGND: BRAKE_FRONT_POT.2(TAP) BRAKE_FRONT_POT.3(BOT) BRAKE_REAR_POT.2(TAP) BRAKE_REAR_POT.3(BOT) C12.1 C13.1 C14.1 C15.1 C17.1 C18.1 C19.1 C20.1 C21.1 C22.1 C29.1 C30.1 R8.1 R9.1 R10.1 R11.1 R17.1 R25.1 R60.1 U2.7(GND) U3.2(V-) U4.4(GND) U5.2(V-) U6.2(V-) U7.2(V-) U15.3(GND) X9.3
0.5V: C12.2 R6.1 R8.2 U5.8(-IN_A) U6.8(-IN_A)
1: X3.1 ; port CURRENT_SENSE_LOW
4.5V: C13.2 R7.1 R9.2 U5.3(+IN_B) U6.3(+IN_B)
BRAKE_FRONT_POT: BRAKE_FRONT_POT.1(TOP) C14.2 R4.1 R10.2 U3.8(-IN_A)
BRAKE_REAR_POT: BRAKE_REAR_POT.1(TOP) C15.2 R5.1 R11.2 U3.4(-IN_B)
BRK_F: U3.1(+IN_A) U5.1(+IN_A) U5.4(-IN_B) ; port BRAKE_FRONT  [project net 5]
BRK_R: U3.3(+IN_B) U6.1(+IN_A) U6.4(-IN_B) ; port BRAKE_REAR  [project net 6]
C_LOW: U7.1(+IN_A) X3.2
OK: D8.1(A) X2.2 ; port BSPD_OK  [project net BSPD_OK_5V]
SENSE_REF: C29.2 R59.1 R60.2 U7.8(-IN_A)
NetD8_2: D8.2(K) R25.2
NetU2_1: U2.1(1A) U5.7(OUT_A)
NetU2_2: U2.2(1B) U5.5(OUT_B)
NetU2_4: U2.4(1C) U6.7(OUT_A)
NetU2_5: U2.5(1D) U6.5(OUT_B)
NetU2_6: U2.6(1Y) U2.13(2D)
NetU2_8: U2.8(2Y) X2.1
NetU2_12: U2.12(2C) U4.7(1Y)
NetU3_5: U3.5(OUT_B) U15.2(B)
NetU3_7: U3.7(OUT_A) U15.1(A)
NetU4_1: U4.1(1A) U15.4(Y)
NetU4_2: U4.2(1B) U7.7(OUT_A)
NetX3_3: X3.3 X9.2

### Notes on the sheet
- Adjustable reference voltage allows for calibration
- BSPD takes in brake signal and battery pack current signal.
  BSPD_OK switches off if:
  >Brakes and throttle activate simultaneously
  >Brake failure (brake signals exceed 4.5V or under 0.5V)
- R10, R11 to be used in case of potentiometer failure
- Reference signal for battery pack current sensor signal. Checks if battery pack output power exceeds 5 kW.
- Bypass jumper connector for testing-purposes
- Jumper connectors for manual adjustment of battery pack current sensor signal. Testing purpose.
- BSPD_OK LED
- Brake System Plausibility Device
- Jonathan Lau
- Labels drawn without touching a wire or pin: AGND

### Library data of the parts
BRAKE_FRONT_POT BRAKE_REAR_POT = 1: idTable: 1; Name: RV6LAYSA502A_rotary_pot; Value: 100-5M Ohms; Manufacturer_id: 1; Drawer_id: 1; Link: https://www.digikey.com/product-detail/en/precision-electronics-corporation/RV6LAYSA502A/RV6L502C-ND/222820; ComponentLink1Description: Datasheet
C12-C15 C29 = 343: Manufacturer_id: 1; idCapacitor: 343; Name: Cap_0.10uf_16V_CAP 0805/2012; Dielectric: Ceramic; Created_By: Nick Mah; Drawer_id: 1; Voltage_Rating: 16V; Package: CAP 0805/2012; Created_Date: 10/20/2018
C17-C22 C30 = 229: as C23 on sheet 5V_out_driver; Drawer_id: 1; Voltage_Rating: 16V; Package: CAP 0603/1608; Created_Date: 10/20/2018
D8 = 2: as RVP_LED on sheet RVP_OVP_HC; Drawer_id: 1; Package: 0805; Link: https://www.digikey.com/product-detail/en/visual-communications-company-vcc/CMD17-21VGD-TR8/L62505CT-ND/254936
R4 R5 R10 R11 = 1842: Manufacturer_id: 1; idResistor: 1842; Name: Res_51k_0805_1/4W_5%; Created_By: Nick Mah; Supplier 1: Digi-Key; Drawer_id: 1; Tolerance: 5%; Power: 1/4W; Package: 0805; ComponentLink1Description: Datasheet; Created_Date: 2018-10-20
R6 R9 = 1831: Manufacturer_id: 1; idResistor: 1831; Name: Res_18k_0805_1/4W_5%; Created_By: Nick Mah; Supplier 1: Digi-Key; Drawer_id: 1; Tolerance: 5%; Power: 1/4W; Package: 0805; ComponentLink1Description: Datasheet; Created_Date: 2018-10-20
R7 R8 = 1808: Manufacturer_id: 1; idResistor: 1808; Name: Res_2.0k_0805_1/4W_5%; Created_By: Nick Mah; Supplier 1: Digi-Key; Drawer_id: 1; Tolerance: 5%; Power: 1/4W; Package: 0805; ComponentLink1Description: Datasheet; Created_Date: 2018-10-20
R17 = 1841: as R39 on sheet 5V_out_driver; Supplier 1: Digi-Key; Drawer_id: 1; Tolerance: 5%; Power: 1/4W; Package: 0805; ComponentLink1Description: Datasheet; Created_Date: 2018-10-20
R25 = 706: Manufacturer_id: 1; idResistor: 706; Name: Res_240_0805_1/4W_1%; Created_By: Nick Mah; Supplier 1: Digi-Key; Drawer_id: 1; Tolerance: 1%; Power: 1/4W; Package: 0805; ComponentLink1Description: Datasheet; Created_Date: 2018-10-20
R59 = 744: Manufacturer_id: 1; idResistor: 744; Name: Res_9.1k_0805_1/4W_1%; Created_By: Nick Mah; Supplier 1: Digi-Key; Drawer_id: 1; Tolerance: 1%; Power: 1/4W; Package: 0805; ComponentLink1Description: Datasheet; Created_Date: 2018-10-20
R60 = 746: Manufacturer_id: 1; idResistor: 746; Name: Res_11k_0805_1/4W_1%; Created_By: Nick Mah; Supplier 1: Digi-Key; Drawer_id: 1; Tolerance: 1%; Power: 1/4W; Package: 0805; ComponentLink1Description: Datasheet; Created_Date: 2018-10-20
U2 = 15: Manufacturer_id: 1; idIC_Misc: 15; Name: 74HC21D_AND_Gate; Drawer_id: 1
U3 U5-U7 = 7: Manufacturer_id: 1; MfrPartNo: LT1018CS8#PBF; idIC_Misc: 7; Drawer_id: 1; Name: LT1018 Dual Comparator; Link: https://www.digikey.com/product-detail/en/linear-technology-analog-devices/LT1018CS8-PBF/LT1018CS8-PBF-ND/894434
U4 = 12: Manufacturer_id: 1; idIC_Misc: 12; Name: SN74LVC2G132DCUR 2channel NAND Gate; Drawer_id: 1
U15 = 14: Manufacturer_id: 1; idIC_Misc: 14; Drawer_id: 1; Name: SN74LVC1G32 OR GATE
X2 X3 X9 = 8: as X4 on sheet Shutdown; Drawer_id: 1; Link: https://www.digikey.com/products/en/connectors-interconnects/rectangular-connectors-headers-male-pins/314?k=jumper&k=&pkeyword=jumper&pv88=5&sf=0&FV=ffe0013a&quantity=&ColumnSort=0&page=1&pageSize=25; ComponentLink1Description: Datasheet

## Sheet LDO_5V.SchDoc
size A
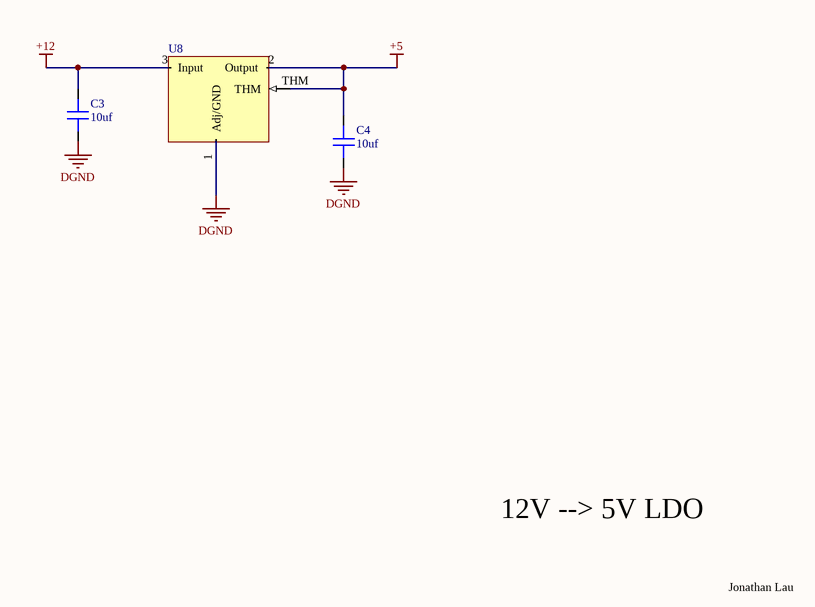
[diagram p7: LDO_5V.SchDoc]

### Parts
C3  value 10uf  [CAP 0805/2012]  (hidden comment: Capacitor MLCC 10uf 16V CAP 0805/2012)
C4  value 10uf  [CAP 0805/2012]  (hidden comment: Capacitor MLCC 10uf 16V CAP 0805/2012)
U8  NCP1117ST50T3G  [SOT-223-3]  (value not drawn)

### Nets
+5: C4.2 U8.2(Output) U8.THM  [project net DVCC]
+12: C3.2 U8.3(Input)
DGND: C3.1 C4.1 U8.1(Adj/GND)

### Notes on the sheet
- 12V --> 5V LDO
- Jonathan Lau

### Library data of the parts
C3 C4 = 355: Manufacturer_id: 1; idCapacitor: 355; Name: Cap_10uf_16V_CAP 0805/2012; Dielectric: Ceramic; Created_By: Nick Mah; Drawer_id: 1; Voltage_Rating: 16V; Package: CAP 0805/2012; Created_Date: 10/20/2018
U8 = 16: Linear Voltage Regulator IC Positive Fixed 1 Output 5V 1A SOT-223; Manufacturer_id: 1; idPMIC_Lin: 16; Name: 5V 1A LDO; Value: 5V 1.0A; Output_Config: 5V Fixed; Vin(Max): 20V; Vout(Min): 4.95; Vout(Max): 5.05; Dropout_Voltage: 1.2V @ 800mA; Created_By: Angel Delgado; Drawer_id: 1; Num_Outputs: 1; Vout_Type: Fixed; Current_Rating: 1A; Package: SOT-223-3; MfrPartNo: NCP1117ST50T3G; Link: https://www.digikey.com/product-detail/en/on-semiconductor/NCP1117ST50T3G/NCP1117ST50T3GOSCT-ND/1967217; ComponentLink1Description: Datasheet; ComponentLink1URL: https://www.onsemi.com/pub/Collateral/NCP1117-D.PDF

## Sheet MC_power_en.SchDoc
size A
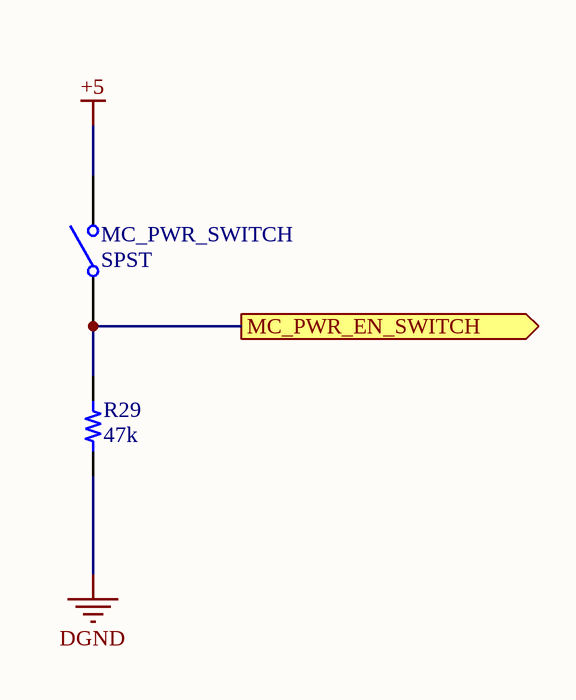
[diagram p8: MC_power_en.SchDoc]

### Parts
MC_PWR_SWITCH  SPST  [M2011SS1W01/UC]
R29  value 47k  [RES 0805/2012]  (hidden comment: Resistor 47k 0805 1/4W 10%)

### Ports
MC_PWR_EN_SWITCH (out)

### Nets
+5: MC_PWR_SWITCH.2(NO)  [project net DVCC]
DGND: R29.1
MC_PWR: MC_PWR_SWITCH.1(COMMON) R29.2 ; port MC_PWR_EN_SWITCH

### Library data of the parts
MC_PWR_SWITCH = 4: Manufacturer_id: 1; MfrPartNo: M2011SS1W01_UC; idTable: 4; Name: M2011SS1W01_UC_SPST_Switch; Voltage_Rating: 125 V; Drawer_id: 1; Link: https://www.digikey.com/product-detail/en/nkk-switches/M2011SS1W01-UC/360-3289-ND/2105194; ComponentLink1Description: Datasheet; ComponentLink1URL: https://www.nkkswitches.com/pdf/MtogglesBushing.pdf
R29 = 2541: Manufacturer_id: 1; idResistor: 2541; Name: Res_47k_0805_1/4W_10%; Created_By: Nick Mah; Supplier 1: Digi-Key; Drawer_id: 1; Tolerance: 10%; Power: 1/4W; Package: 0805; ComponentLink1Description: Datasheet; Created_Date: 2018-10-20

## Sheet MCU_MKE185F512VLH16.SchDoc: Microcontroller
size A4; DrawnBy: Alvin Ha; DocumentNumber: MCU2018-2; Revision: 2.0; SheetNumber: 2; SheetTotal: 4
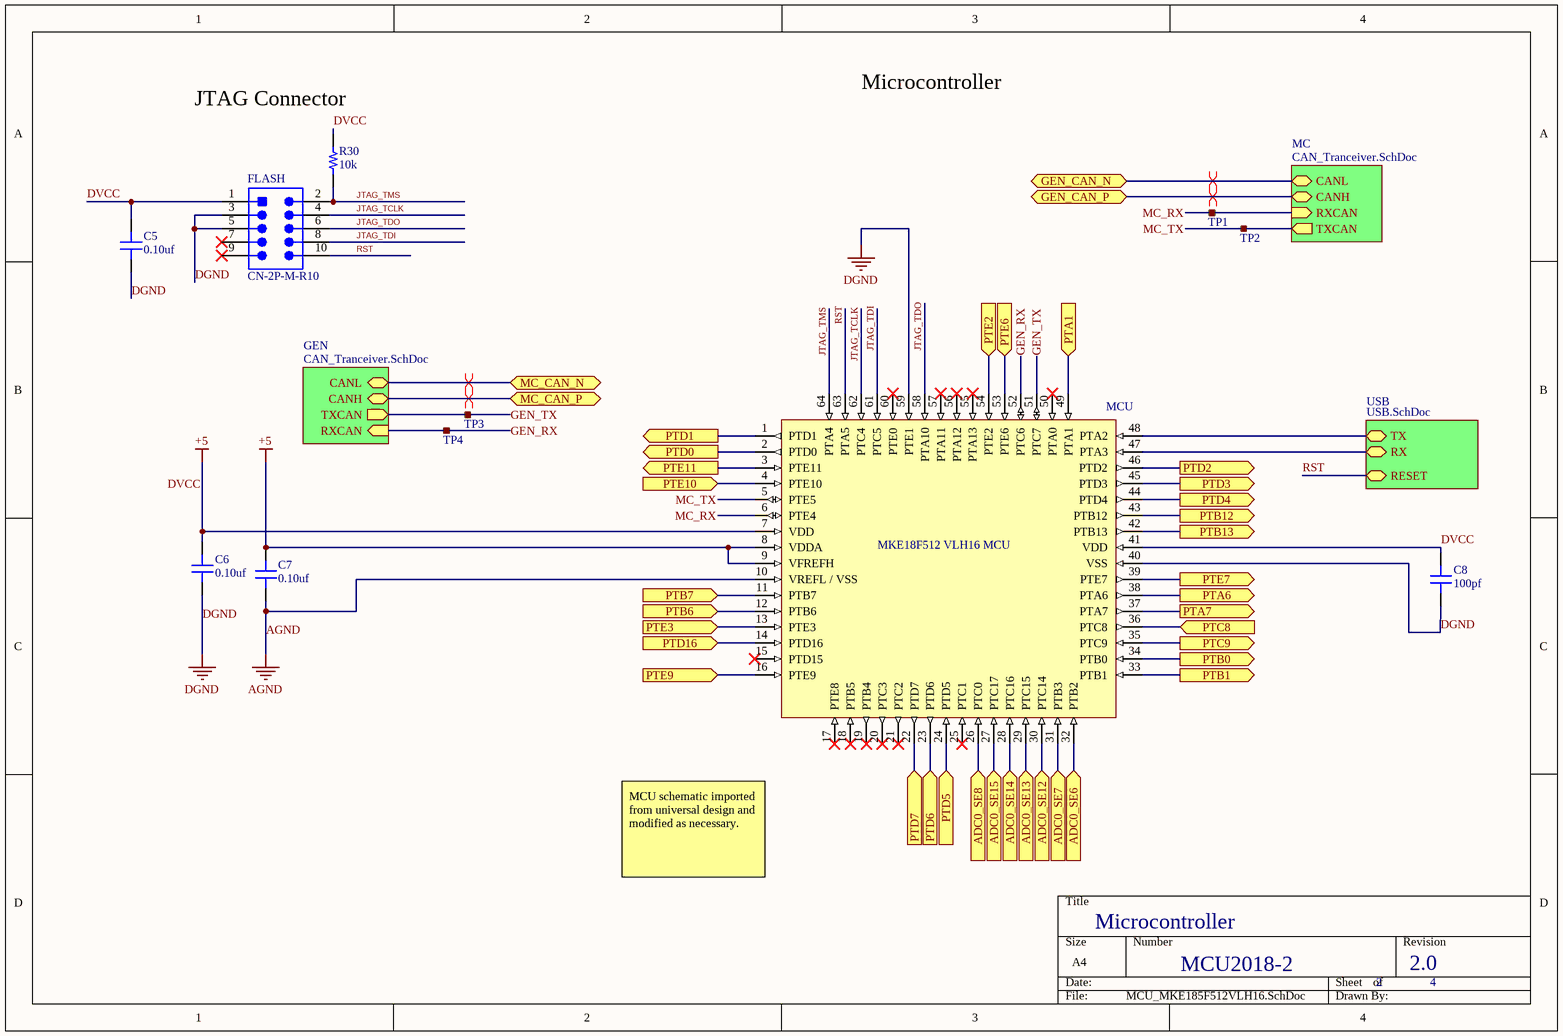
[diagram p9: MCU_MKE185F512VLH16.SchDoc]

### Parts
C5  value 0.10uf  [CAP 0603/1608]  (hidden comment: Capacitor MLCC 0.10uf 16V CAP 0603/1608)
C6  value 0.10uf  [CAP 0603/1608]  (hidden comment: Capacitor MLCC 0.10uf 25V CAP 0603/1608)
C7  value 0.10uf  [CAP 0603/1608]  (hidden comment: Capacitor MLCC 0.10uf 25V CAP 0603/1608)
C8  value 100pf  [CAP 0603/1608]  (hidden comment: Capacitor MLCC 100pf 25V CAP 0603/1608)
FLASH  CN-2P-M-R10  [HDR2X5_SMT]
MCU  MKE18F512 VLH16 MCU  [TQFP64]
R30  value 10k  [RES 0603/1608]  (hidden comment: Resistor 10k 0603 1/10W 1%)
TP1  RCU-0C  [RCU-0C]  (value not drawn)
TP2  RCU-0C  [RCU-0C]  (value not drawn)
TP3  RCU-0C  [RCU-0C]  (value not drawn)
TP4  RCU-0C  [RCU-0C]  (value not drawn)

### Sub-sheets
GEN = CAN_Tranceiver.SchDoc: CANL (bidir), CANH (bidir), RXCAN (in), TXCAN (out)
MC = CAN_Tranceiver.SchDoc: CANL (bidir), CANH (bidir), RXCAN (in), TXCAN (out)
USB = USB.SchDoc: TX (bidir), RESET (bidir), RX (bidir)

### Ports
ADC0_SE6 (in), ADC0_SE7 (in), ADC0_SE8 (in), ADC0_SE12 (in), ADC0_SE13 (in), ADC0_SE14 (in), ADC0_SE15 (in), GEN_CAN_N (bidir), GEN_CAN_P (bidir), MC_CAN_N (bidir), MC_CAN_P (bidir), PTA1 (in), PTA6 (out), PTA7 (out), PTB0 (out), PTB1 (out), PTB6 (in), PTB7 (in), PTB12 (out), PTB13 (out), PTC8 (in), PTC9 (out), PTD0 (out), PTD1 (out), PTD2 (out), PTD3 (out), PTD4 (out), PTD5 (in), PTD6 (in), PTD7 (in), PTD16 (in), PTE2 (in), PTE3 (in), PTE6 (in), PTE7 (out), PTE9 (in), PTE10 (in), PTE11 (out)

### Nets
AGND: C7.1 MCU.10(VREFL_/_VSS)
DGND: C5.1 C6.1 C8.1 FLASH.3 FLASH.5 MCU.40(VSS) MCU.59(PTE1)
DVCC: C5.2 C6.2 C7.2 C8.2 FLASH.1 MCU.7(VDD) MCU.8(VDDA) MCU.9(VFREFH) MCU.41(VDD) R30.2  [also labelled +5]
1: MCU.32(PTB2) ; port ADC0_SE6
3: MCU.28(PTC16) ; port ADC0_SE14
4: MCU.27(PTC17) ; port ADC0_SE15
5: MCU.31(PTB3) ; port ADC0_SE7
6: MCU.30(PTC14) ; port ADC0_SE12
7: MCU.29(PTC15) ; port ADC0_SE13
8: MCU.23(PTD6) ; port PTD6
9: MCU.24(PTD5) ; port PTD5
10: MCU.22(PTD7) ; port PTD7
AIR+_5V: MCU.34(PTB0) ; port PTB0
AIR-_5V: MCU.35(PTC9) ; port PTC9
BMS_OK_5V: MCU.13(PTE3) ; port PTE3
BRK_LIT_5V: MCU.33(PTB1) ; port PTB1
BSPD_OK_5V: MCU.36(PTC8) ; port PTC8
CAN_GEN_H: port GEN_CAN_P, sheet MC/CANH
CAN_GEN_L: port GEN_CAN_N, sheet MC/CANL
CAN_MC_H: port MC_CAN_P, sheet GEN/CANH
CAN_MC_L: port MC_CAN_N, sheet GEN/CANL
DCDC_DIS_5V: MCU.45(PTD3) ; port PTD3
DSCHRG_5V: MCU.43(PTB12) ; port PTB12
FAN_EN: MCU.2(PTD0) ; port PTD0
FAN_PWM: MCU.1(PTD1) ; port PTD1
FTDI_UART_RX: MCU.47(PTA3) ; sheet USB/RX
FTDI_UART_TX: MCU.48(PTA2) ; sheet USB/TX
GEN_PURP_1_5V: MCU.37(PTA7) ; port PTA7
GEN_PURP_2_5V: MCU.46(PTD2) ; port PTD2
GEN_RX: MCU.52(PTC6) TP4.1 ; sheet GEN/RXCAN
GEN_TX: MCU.51(PTC7) TP3.1 ; sheet GEN/TXCAN
IMD_OK_5V: MCU.14(PTD16) ; port PTD16
JTAG_TCLK: FLASH.4 MCU.62(PTC4)
JTAG_TDI: FLASH.8 MCU.61(PTC5)
JTAG_TDO: FLASH.6 MCU.58(PTA10)
JTAG_TMS: FLASH.2 MCU.64(PTA4) R30.1
LATCH_SENSE_OUT: MCU.49(PTA1) ; port PTA1
MC_EN_5V: MCU.53(PTE6) ; port PTE6
MC_RX: MCU.6(PTE4) TP1.1 ; sheet MC/RXCAN
MC_TX: MCU.5(PTE5) TP2.1 ; sheet MC/TXCAN
PRCHRG_5V: MCU.42(PTB13) ; port PTB13
PUMP_EN: MCU.3(PTE11) ; port PTE11
REDUN_1_MCU: MCU.39(PTE7) ; port PTE7
REDUN_2_MCU: MCU.38(PTA6) ; port PTA6
RST: FLASH.10 MCU.63(PTA5) ; sheet USB/RESET  [project net RESET]
RTDS_5V: MCU.44(PTD4) ; port PTD4
TS_LIVE_5V: MCU.11(PTB7) ; port PTB7
TS_RDY_5V: MCU.54(PTE2) ; port PTE2
TS_RDY_SNS_OUT: MCU.12(PTB6) ; port PTB6
NetMCU_4: MCU.4(PTE10) ; port PTE10
NetMCU_16: MCU.16(PTE9) ; port PTE9
NetMCU_26: MCU.26(PTC0) ; port ADC0_SE8

Not connected (* = marked no-connect by the designer): FLASH 7* 9*; MCU 15(PTD15)* 17(PTE8)* 18(PTB5)* 19(PTB4)* 20(PTC3)* 21(PTC2)* 25(PTC1)* 50(PTA0)* 55(PTA13)* 56(PTA12)* 57(PTA11)* 60(PTE0)*

### Layout directives
differential pair: CAN_GEN_H, CAN_GEN_L, CAN_MC_H, CAN_MC_L

### Notes on the sheet
- (near R30) JTAG Connector
- Microcontroller
- MCU schematic imported from universal design and modified as necessary.

### Library data of the parts
C5 = 223: Manufacturer_id: 1; idCapacitor: 223; Name: Cap_0.10uf_16V_CAP 0603/1608; Dielectric: Ceramic; Created_By: Nick Mah; Drawer_id: 1; Voltage_Rating: 16V; Package: CAP 0603/1608; Created_Date: 10/20/2018
C6 C7 = 583: Manufacturer_id: 1; idCapacitor: 583; Name: Cap_0.10uf_25V_CAP 0603/1608; Dielectric: Ceramic; Created_By: Nick Mah; Drawer_id: 1; Voltage_Rating: 25V; Package: CAP 0603/1608; Created_Date: 10/20/2018
C8 = 529: Manufacturer_id: 1; idCapacitor: 529; Name: Cap_100pf_25V_CAP 0603/1608; Dielectric: Ceramic; Created_By: Nick Mah; Drawer_id: 1; Voltage_Rating: 25V; Package: CAP 0603/1608; Created_Date: 10/20/2018
FLASH = 4: 2 row connector; Manufacturer_id: 1; MfrPartNo: 5103309-1; idConn: 4; Name: CONN_TE_2X5POS; Value: CONN; Voltage_Rating: None; Num_Contacts: 10; Num_Rows: 2; Pitch: 2.54mm; Created_By: Aiku; Drawer_id: 1; Link: https://www.digikey.com/product-detail/en/5103309-1/A33160-ND/1114898?utm_campaign=buynow&WT.z_cid=ref_octopart_dkc_buynow&utm_medium=aggregator&curr=usd&site=us&utm_source=octopart; ComponentLink1Description: Datasheet
MCU = 1: idMCU: 1; Manufacturer_id: 1; Drawer_id: 1; Name: MKE18F512VLH16 MCU
R30 = 313: Manufacturer_id: 1; idResistor: 313; Name: Res_10k_0603_1/10W_1%; Created_By: Nick Mah; Supplier 1: Digi-Key; Drawer_id: 1; Tolerance: 1%; Power: 1/10W; Package: 0603; ComponentLink1Description: Datasheet; Created_Date: 2018-10-20
TP1-TP4 = 5: as TP5 on sheet 5V_out_driver; Drawer_id: 1; Package: 0603; MfrPartNo: RCU-0C; Link: https://www.digikey.com/product-detail/en/te-connectivity-amp-connectors/RCU-0C/A106145CT-ND/3477802; ComponentLink1Description: Datasheet; ComponentLink1URL: https://www.te.com/commerce/DocumentDelivery/DDEController?Action=srchrtrv&DocNm=1773266&DocType=DS&DocLang=English